# Altium project Drive_edu_bench.PrjPcb (part 1 of 2)
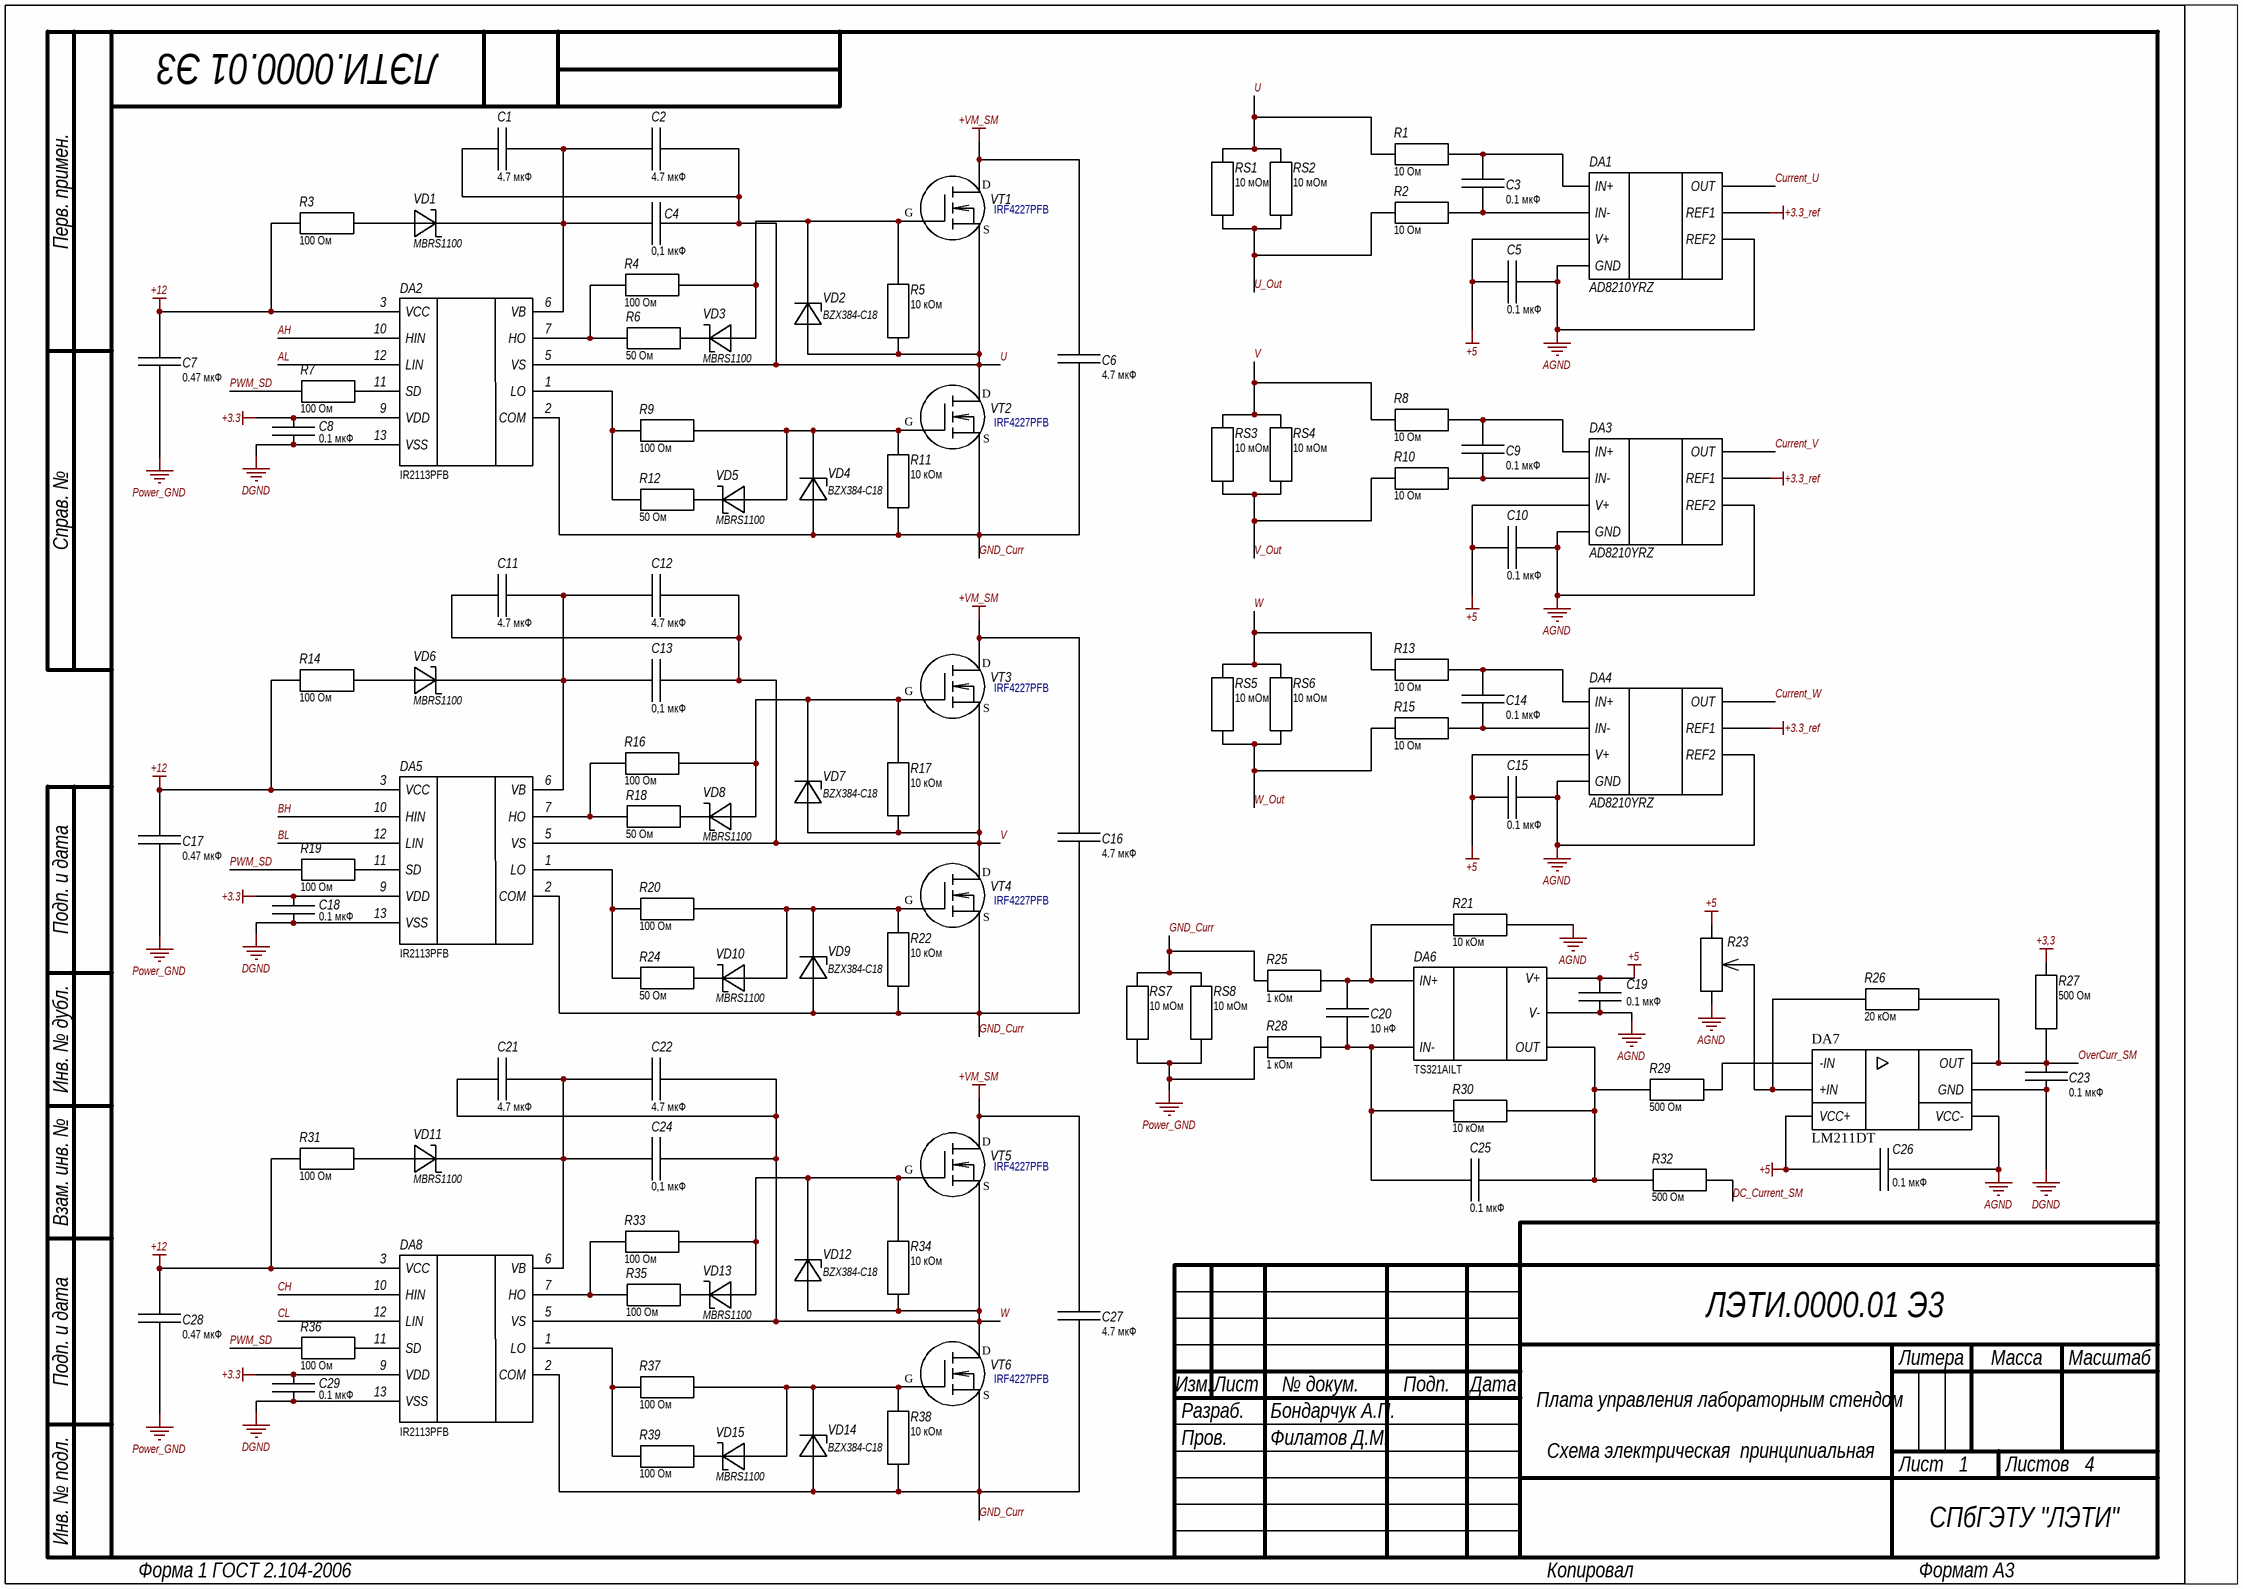
[diagram p0: Voltege_inverter.SchDoc]
7 sheets, 398 parts. Net scope: global (net labels, ports and power ports of the same name join across sheets).
Board file: board.PcbDoc
Sheets:
  Voltege_inverter.SchDoc
  power.SchDoc
  Control_part.SchDoc
  position_sensors.SchDoc
  Communication_interfaces.SchDoc
  protections.SchDoc
  protections_1.SchDoc

## Sheet Voltege_inverter.SchDoc
size 420 x 297 mm; CheckedBy: Филатов Д.М.; Author: Бондарчук А.П.; CompanyName: СПбГЭТУ "ЛЭТИ"; Organization: СПбГЭТУ "ЛЭТИ"; DocumentNumber: ЛЭТИ.0000.01 Э3; SheetNumber: 1; SheetTotal: 4

### Parts
C1  value 4.7 мкФ  [CC1210]  (hidden comment: Capacitor)
C2  value 4.7 мкФ  [CC1210]  (hidden comment: Capacitor)
C3  value 0.1 мкФ  [CC1206]  (hidden comment: Capacitor)
C4  value 0,1 мкФ  [CC0805]  (hidden comment: Capacitor)
C5  value 0.1 мкФ  [CC0603]  (hidden comment: Capacitor)
C6  value 4.7 мкФ  [CC1210]  (hidden comment: Capacitor)
C7  value 0.47 мкФ  [CC1206]  (hidden comment: Capacitor)
C8  value 0.1 мкФ  [CC0603]  (hidden comment: Capacitor)
C9  value 0.1 мкФ  [CC1206]  (hidden comment: Capacitor)
C10  value 0.1 мкФ  [CC0603]  (hidden comment: Capacitor)
C11  value 4.7 мкФ  [CC1210]  (hidden comment: Capacitor)
C12  value 4.7 мкФ  [CC1210]  (hidden comment: Capacitor)
C13  value 0,1 мкФ  [CC0805]  (hidden comment: Capacitor)
C14  value 0.1 мкФ  [CC1206]  (hidden comment: Capacitor)
C15  value 0.1 мкФ  [CC0603]  (hidden comment: Capacitor)
C16  value 4.7 мкФ  [CC1210]  (hidden comment: Capacitor)
C17  value 0.47 мкФ  [CC1206]  (hidden comment: Capacitor)
C18  value 0.1 мкФ  [CC0603]  (hidden comment: Capacitor)
C19  value 0.1 мкФ  [CC0603]  (hidden comment: Capacitor)
C20  value 10 нФ  [CC0805]  (hidden comment: Capacitor)
C21  value 4.7 мкФ  [CC1210]  (hidden comment: Capacitor)
C22  value 4.7 мкФ  [CC1210]  (hidden comment: Capacitor)
C23  value 0.1 мкФ  [CC0603]  (hidden comment: Capacitor)
C24  value 0,1 мкФ  [CC0805]  (hidden comment: Capacitor)
C25  value 0.1 мкФ  [CC1206]  (hidden comment: Capacitor)
C26  value 0.1 мкФ  [CC0603]  (hidden comment: Capacitor)
C27  value 4.7 мкФ  [CC1210]  (hidden comment: Capacitor)
C28  value 0.47 мкФ  [CC1206]  (hidden comment: Capacitor)
C29  value 0.1 мкФ  [CC0603]  (hidden comment: Capacitor)
DA1  AD8210YRZ  [SO8]
DA2  IR2113PFB  [DIP14]
DA3  AD8210YRZ  [SO8]
DA4  AD8210YRZ  [SO8]
DA5  IR2113PFB  [DIP14]
DA6  TS321AILT  [SOT-23-5]
DA7  LM211DT  [SO8]
DA8  IR2113PFB  [DIP14]
R1  value 10 Ом  [RC1206]  (hidden comment: Resistor)
R2  value 10 Ом  [RC1206]  (hidden comment: Resistor)
R3  value 100 Ом  [RC2512]  (hidden comment: Resistor)
R4  value 100 Ом  [RC2512]  (hidden comment: Resistor)
R5  value 10 кОм  [RC0805]  (hidden comment: Resistor)
R6  value 50 Ом  [RC2512]  (hidden comment: Resistor)
R7  value 100 Ом  [RC0603]  (hidden comment: Resistor)
R8  value 10 Ом  [RC1206]  (hidden comment: Resistor)
R9  value 100 Ом  [RC2512]  (hidden comment: Resistor)
R10  value 10 Ом  [RC1206]  (hidden comment: Resistor)
R11  value 10 кОм  [RC0805]  (hidden comment: Resistor)
R12  value 50 Ом  [RC2512]  (hidden comment: Resistor)
R13  value 10 Ом  [RC1206]  (hidden comment: Resistor)
R14  value 100 Ом  [RC2512]  (hidden comment: Resistor)
R15  value 10 Ом  [RC1206]  (hidden comment: Resistor)
R16  value 100 Ом  [RC2512]  (hidden comment: Resistor)
R17  value 10 кОм  [RC0805]  (hidden comment: Resistor)
R18  value 50 Ом  [RC2512]  (hidden comment: Resistor)
R19  value 100 Ом  [RC0603]  (hidden comment: Resistor)
R20  value 100 Ом  [RC2512]  (hidden comment: Resistor)
R21  value 10 кОм  [RC0805]  (hidden comment: Resistor)
R22  value 10 кОм  [RC0805]  (hidden comment: Resistor)
R23  pot  [3296W]  (value not drawn)
R24  value 50 Ом  [RC2512]  (hidden comment: Resistor)
R25  value 1 кОм  [RC0805]  (hidden comment: Resistor)
R26  value 20 кОм  [RC0805]  (hidden comment: Resistor)
R27  value 500 Ом  [RC0805]  (hidden comment: Resistor)
R28  value 1 кОм  [RC0805]  (hidden comment: Resistor)
R29  value 500 Ом  [RC0805]  (hidden comment: Resistor)
R30  value 10 кОм  [RC0805]  (hidden comment: Resistor)
R31  value 100 Ом  [RC2512]  (hidden comment: Resistor)
R32  value 500 Ом  [RC0805]  (hidden comment: Resistor)
R33  value 100 Ом  [RC2512]  (hidden comment: Resistor)
R34  value 10 кОм  [RC0805]  (hidden comment: Resistor)
R35  value 100 Ом  [RC2512]  (hidden comment: Resistor)
R36  value 100 Ом  [RC0603]  (hidden comment: Resistor)
R37  value 100 Ом  [RC2512]  (hidden comment: Resistor)
R38  value 10 кОм  [RC0805]  (hidden comment: Resistor)
R39  value 100 Ом  [RC2512]  (hidden comment: Resistor)
RS1  value 10 мОм  [RC2816]  (hidden comment: Resistor)
RS2  value 10 мОм  [RC2816]  (hidden comment: Resistor)
RS3  value 10 мОм  [RC2816]  (hidden comment: Resistor)
RS4  value 10 мОм  [RC2816]  (hidden comment: Resistor)
RS5  value 10 мОм  [RC2816]  (hidden comment: Resistor)
RS6  value 10 мОм  [RC2816]  (hidden comment: Resistor)
RS7  value 10 мОм  [RC2816]  (hidden comment: Resistor)
RS8  value 10 мОм  [RC2816]  (hidden comment: Resistor)
VD1  MBRS1100  [DO-214AA]
VD2  BZX384-C18  [SOD323]
VD3  MBRS1100  [DO-214AA]
VD4  BZX384-C18  [SOD323]
VD5  MBRS1100  [DO-214AA]
VD6  MBRS1100  [DO-214AA]
VD7  BZX384-C18  [SOD323]
VD8  MBRS1100  [DO-214AA]
VD9  BZX384-C18  [SOD323]
VD10  MBRS1100  [DO-214AA]
VD11  MBRS1100  [DO-214AA]
VD12  BZX384-C18  [SOD323]
VD13  MBRS1100  [DO-214AA]
VD14  BZX384-C18  [SOD323]
VD15  MBRS1100  [DO-214AA]
VT1  IRF4227PFB  [TO247-1]
VT2  IRF4227PFB  [TO247-1]
VT3  IRF4227PFB  [TO247-1]
VT4  IRF4227PFB  [TO247-1]
VT5  IRF4227PFB  [TO247-1]
VT6  IRF4227PFB  [TO247-1]

### Nets
+3,3: R27.2
+3.3: C8.2 C18.2 C29.2 DA2.9(VDD) DA5.9(VDD) DA8.9(VDD)
+3.3_ref: DA1.7(REF1) DA3.7(REF1) DA4.7(REF1)
+5: C5.2 C10.2 C15.2 C19.1 C26.1 DA1.6(V+) DA3.6(V+) DA4.6(V+) DA6.5(V+) DA7.8(VCC+) R23.1
+12: C7.2 C17.2 C28.2 DA2.3(VCC) DA5.3(VCC) DA8.3(VCC) R3.2 R14.2 R31.2
+VM_SM: C6.2 C16.2 C27.2 VT1.D VT3.D VT5.D
AGND: C5.1 C10.1 C15.1 C19.2 C26.2 DA1.2(GND) DA1.3(REF2) DA3.2(GND) DA3.3(REF2) DA4.2(GND) DA4.3(REF2) DA6.2(V-) DA7.4(VCC-) R21.2 R23.3
DGND: C8.1 C18.1 C23.1 C29.1 DA2.13(VSS) DA5.13(VSS) DA7.1(GND) DA8.13(VSS)
Power_GND: C7.1 C17.1 C28.1 R28.1 RS7.2 RS8.2
AH: DA2.10(HIN)
AL: DA2.12(LIN)
BH: DA5.10(HIN)
BL: DA5.12(LIN)
CH: DA8.10(HIN)
CL: DA8.12(LIN)
Current_U: DA1.5(OUT)
Current_V: DA3.5(OUT)
Current_W: DA4.5(OUT)
DC_Current_SM: R32.2
GND_Curr: C6.1 C16.1 C27.1 DA2.2(COM) DA5.2(COM) DA8.2(COM) R11.2 R22.2 R25.1 R38.2 RS7.1 RS8.1 VD4.A VD9.A VD14.A VT2.S VT4.S VT6.S
OverCurr_SM: C23.2 DA7.7(OUT) R26.2 R27.1
PWM_SD: R7.2 R19.2 R36.2
U: C1.2 C2.1 C4.1 DA2.5(VS) R1.2 R5.2 RS1.1 RS2.1 VD2.A VT1.S VT2.D
U_Out: R2.2 RS1.2 RS2.2
V: C11.2 C12.1 C13.1 DA5.5(VS) R8.2 R17.2 RS3.1 RS4.1 VD7.A VT3.S VT4.D
V_Out: R10.2 RS3.2 RS4.2
W: C21.2 C22.1 C24.1 DA8.5(VS) R13.2 R34.2 RS5.1 RS6.1 VD12.A VT5.S VT6.D
W_Out: R15.2 RS5.2 RS6.2
NetC1_1: C1.1 C2.2 C4.2 DA2.6(VB) VD1.C
NetC3_1: C3.1 DA1.8(IN+) R1.1
NetC3_2: C3.2 DA1.1(IN-) R2.1
NetC9_1: C9.1 DA3.8(IN+) R8.1
NetC9_2: C9.2 DA3.1(IN-) R10.1
NetC11_1: C11.1 C12.2 C13.2 DA5.6(VB) VD6.C
NetC14_1: C14.1 DA4.8(IN+) R13.1
NetC14_2: C14.2 DA4.1(IN-) R15.1
NetC20_1: C20.1 DA6.3(IN+) R21.1 R25.2
NetC20_2: C20.2 C25.1 DA6.4(IN-) R28.2 R30.1
NetC21_1: C21.1 C22.2 C24.2 DA8.6(VB) VD11.C
NetC25_2: C25.2 DA6.1(OUT) R29.1 R30.2 R32.1
NetDA2_1: DA2.1(LO) R9.2 R12.2
NetDA2_7: DA2.7(HO) R4.2 R6.2
NetDA2_11: DA2.11(SD) R7.1
NetDA5_1: DA5.1(LO) R20.2 R24.2
NetDA5_7: DA5.7(HO) R16.2 R18.2
NetDA5_11: DA5.11(SD) R19.1
NetDA7_2: DA7.2(+IN) R23.2 R26.1
NetDA7_3: DA7.3(-IN) R29.2
NetDA8_1: DA8.1(LO) R37.2 R39.2
NetDA8_7: DA8.7(HO) R33.2 R35.2
NetDA8_11: DA8.11(SD) R36.1
NetR3_1: R3.1 VD1.A
NetR4_1: R4.1 R5.1 VD2.C VD3.A VT1.G
NetR6_1: R6.1 VD3.C
NetR9_1: R9.1 R11.1 VD4.C VD5.A
NetR12_1: R12.1 VD5.C
NetR14_1: R14.1 VD6.A
NetR16_1: R16.1 R17.1 VD7.C VD8.A VT3.G
NetR18_1: R18.1 VD8.C
NetR20_1: R20.1 R22.1 VD9.C VD10.A
NetR24_1: R24.1 VD10.C
NetR31_1: R31.1 VD11.A
NetR33_1: R33.1 R34.1 VD12.C VD13.A VT5.G
NetR35_1: R35.1 VD13.C
NetR37_1: R37.1 R38.1 VD14.C VD15.A
NetR39_1: R39.1 VD15.C

Not connected (* = marked no-connect by the designer): VT2 G; VT4 G; VT6 G

### Notes on the sheet
- Плата управления лабораторным стендом
- Перв. примен.
- Справ. №
- Подп. и дата
- Инв. № дубл.
- Взам. инв. №
- Разраб.
- Изм.
- Лист
- № докум.
- Подп.
- Дата
- Литера
- Масса
- Масштаб
- Пров.
- Схема электрическая  принципиальная
- Листов
- Инв. № подл.
- Форма 1 ГОСТ 2.104-2006
- Копировал
- Формат А3

### Library data of the parts
C1-C4 C6 C9 C11-C14 C16 C21 C22 C24 C25 C27 = Capacitor: Voltage: 100В; ComponentLink1Description: Product link; GOST_Name_2: 100В; GOST_Name_0: -
  C1 C2 C6 C11 C12 C16 C21 C22 C27: ComponentLink1URL: https://www.promelec.ru/product/413761/; Name: CC1210; GOST_Name_3: 4.7 мкФ
  C3 C9 C14 C25: ComponentLink1URL: *; Name: CC1206; GOST_Name_3: 0.1 мкФ
  C4 C13 C24: ComponentLink1URL: *; Name: CC0805; GOST_Name_3: 0,1 мкФ
C5 C8 C10 C15 C18 C19 C23 C26 C29 = Capacitor: Voltage: 16В; ComponentLink1Description: Product link; ComponentLink1URL: *; Name: CC0603; GOST_Name_2: 16В; GOST_Name_3: 0.1 мкФ; GOST_Name_0: -
C7 C17 C20 C28 = Capacitor: Voltage: 50В; ComponentLink1Description: Product link; ComponentLink1URL: *; GOST_Name_2: 50В; GOST_Name_0: -
  C7 C17 C28: Name: CC1206; GOST_Name_3: 0.47 мкФ
  C20: Name: CC0805; GOST_Name_3: 10 нФ
DA1 DA3 DA4 = AD8210: Name: AD8210YRZ, ф Analog Devices; ComponentLink1Description: Product link; ComponentLink1URL: https://www.chipdip.ru/product/ad8210yrz; Datasheet: https://static.chipdip.ru/lib/693/DOC011693392.pdf; GOST_Name_1: AD8210YRZ, ф Analog Devices
DA2 DA5 DA8 = IR2113PFB: Name: IR2113PBF, ф. Infineon Technologies; ComponentLink1Description: Product link; ComponentLink1URL: https://www.promelec.ru/product/39435/; GOST_Name_1: IR2113PBF, ф. Infineon Technologies
DA6 = TS321AILT: Одиночный операционный усилитель.; Name: TS321AILT ф. STMicroelectronics; ComponentLink1Description: Product link; ComponentLink1URL: https://www.chipdip.ru/product/ts321ailt-stm; Datasheet: https://static.chipdip.ru/lib/693/DOC011693392.pdf; GOST_Name_1: TS321AILT ф. STMicroelectronics
DA7 = LM211DT: Компаратор; GOST_Name_1: LM211DT, ф ST Microelectronics; ComponentLink1Description: Product link; ComponentLink1URL: https://www.promelec.ru/product/40196/
R1 R2 R8 R10 R13 R15 = Resistor: Power: 250 мВт; ComponentLink1Description: Product link; ComponentLink1URL: *; Name: RC1206; GOST_Name_2: 250 мВт; GOST_Name_3: 10 Ом; GOST_Name_0: -
R3 R4 R6 R9 R12 R14 R16 R18 R20 R24 R31 R33 R35 R37 R39 = Resistor: Power: 1 Вт; ComponentLink1Description: Product link; ComponentLink1URL: *; Name: RC2512; GOST_Name_2: 1 Вт; GOST_Name_0: -
  R3 R4 R9 R14 R16 R20 R31 R33 R35 R37 R39: GOST_Name_3: 100 Ом
  R6 R12 R18 R24: GOST_Name_3: 50 Ом
R5 R11 R17 R21 R22 R25-R30 R32 R34 R38 = Resistor: Power: 125 мВт; ComponentLink1Description: Product link; ComponentLink1URL: *; Name: RC0805; GOST_Name_2: 125 мВт; GOST_Name_0: -
  R5 R11 R17 R21 R22 R30 R34 R38: GOST_Name_3: 10 кОм
  R25 R28: GOST_Name_3: 1 кОм
  R26: GOST_Name_3: 20 кОм
  R27 R29 R32: GOST_Name_3: 500 Ом
R7 R19 R36 = Resistor: Power: 100 мВт; ComponentLink1Description: Product link; ComponentLink1URL: *; Name: RC0603; GOST_Name_2: 100 мВт; GOST_Name_3: 100 Ом; GOST_Name_0: -
R23 = pot: Name: 10 кОм ± 20% 0,5 Вт, 3296W-1-103LF, ф. Bourns; ComponentLink1Description: Product link; GOST_Name_1: 10 кОм ± 20% 0,5 Вт, 3296W-1-103LF, ф. Bourns
RS1-RS8 = Resistor: Power: 2 Вт; ComponentLink1Description: Product link; ComponentLink1URL: *; Name: RC2816; GOST_Name_2: 2 Вт; GOST_Name_3: 10 мОм; GOST_Name_0: -
VD1 VD3 VD5 VD6 VD8 VD10 VD11 VD13 VD15 = Shotki: Name: MBRS1100, 100В, 1А, ф. Sunmate Electronics; ComponentLink1Description: Product link; ComponentLink1URL: https://www.chipdip.ru/product/mbrs1100; GOST_Name_1: MBRS1100, 100В, 1А, ф. Sunmate Electronics
VD2 VD4 VD7 VD9 VD12 VD14 = Zener diode: Name: BZX384-C18,115, Стабилитрон 18В 0.3Вт, ф Nexperia; ComponentLink1Description: Product link; ComponentLink1URL: https://www.chipdip.ru/product/bzx384-c18.115; GOST_Name_1: BZX384-C18,115, Стабилитрон 18В 0.3Вт, ф Nexperia
VT1-VT6 = N-MOSFET: Name: IRF4227PFB

## Sheet power.SchDoc
size 420 x 297 mm; SheetNumber: 3
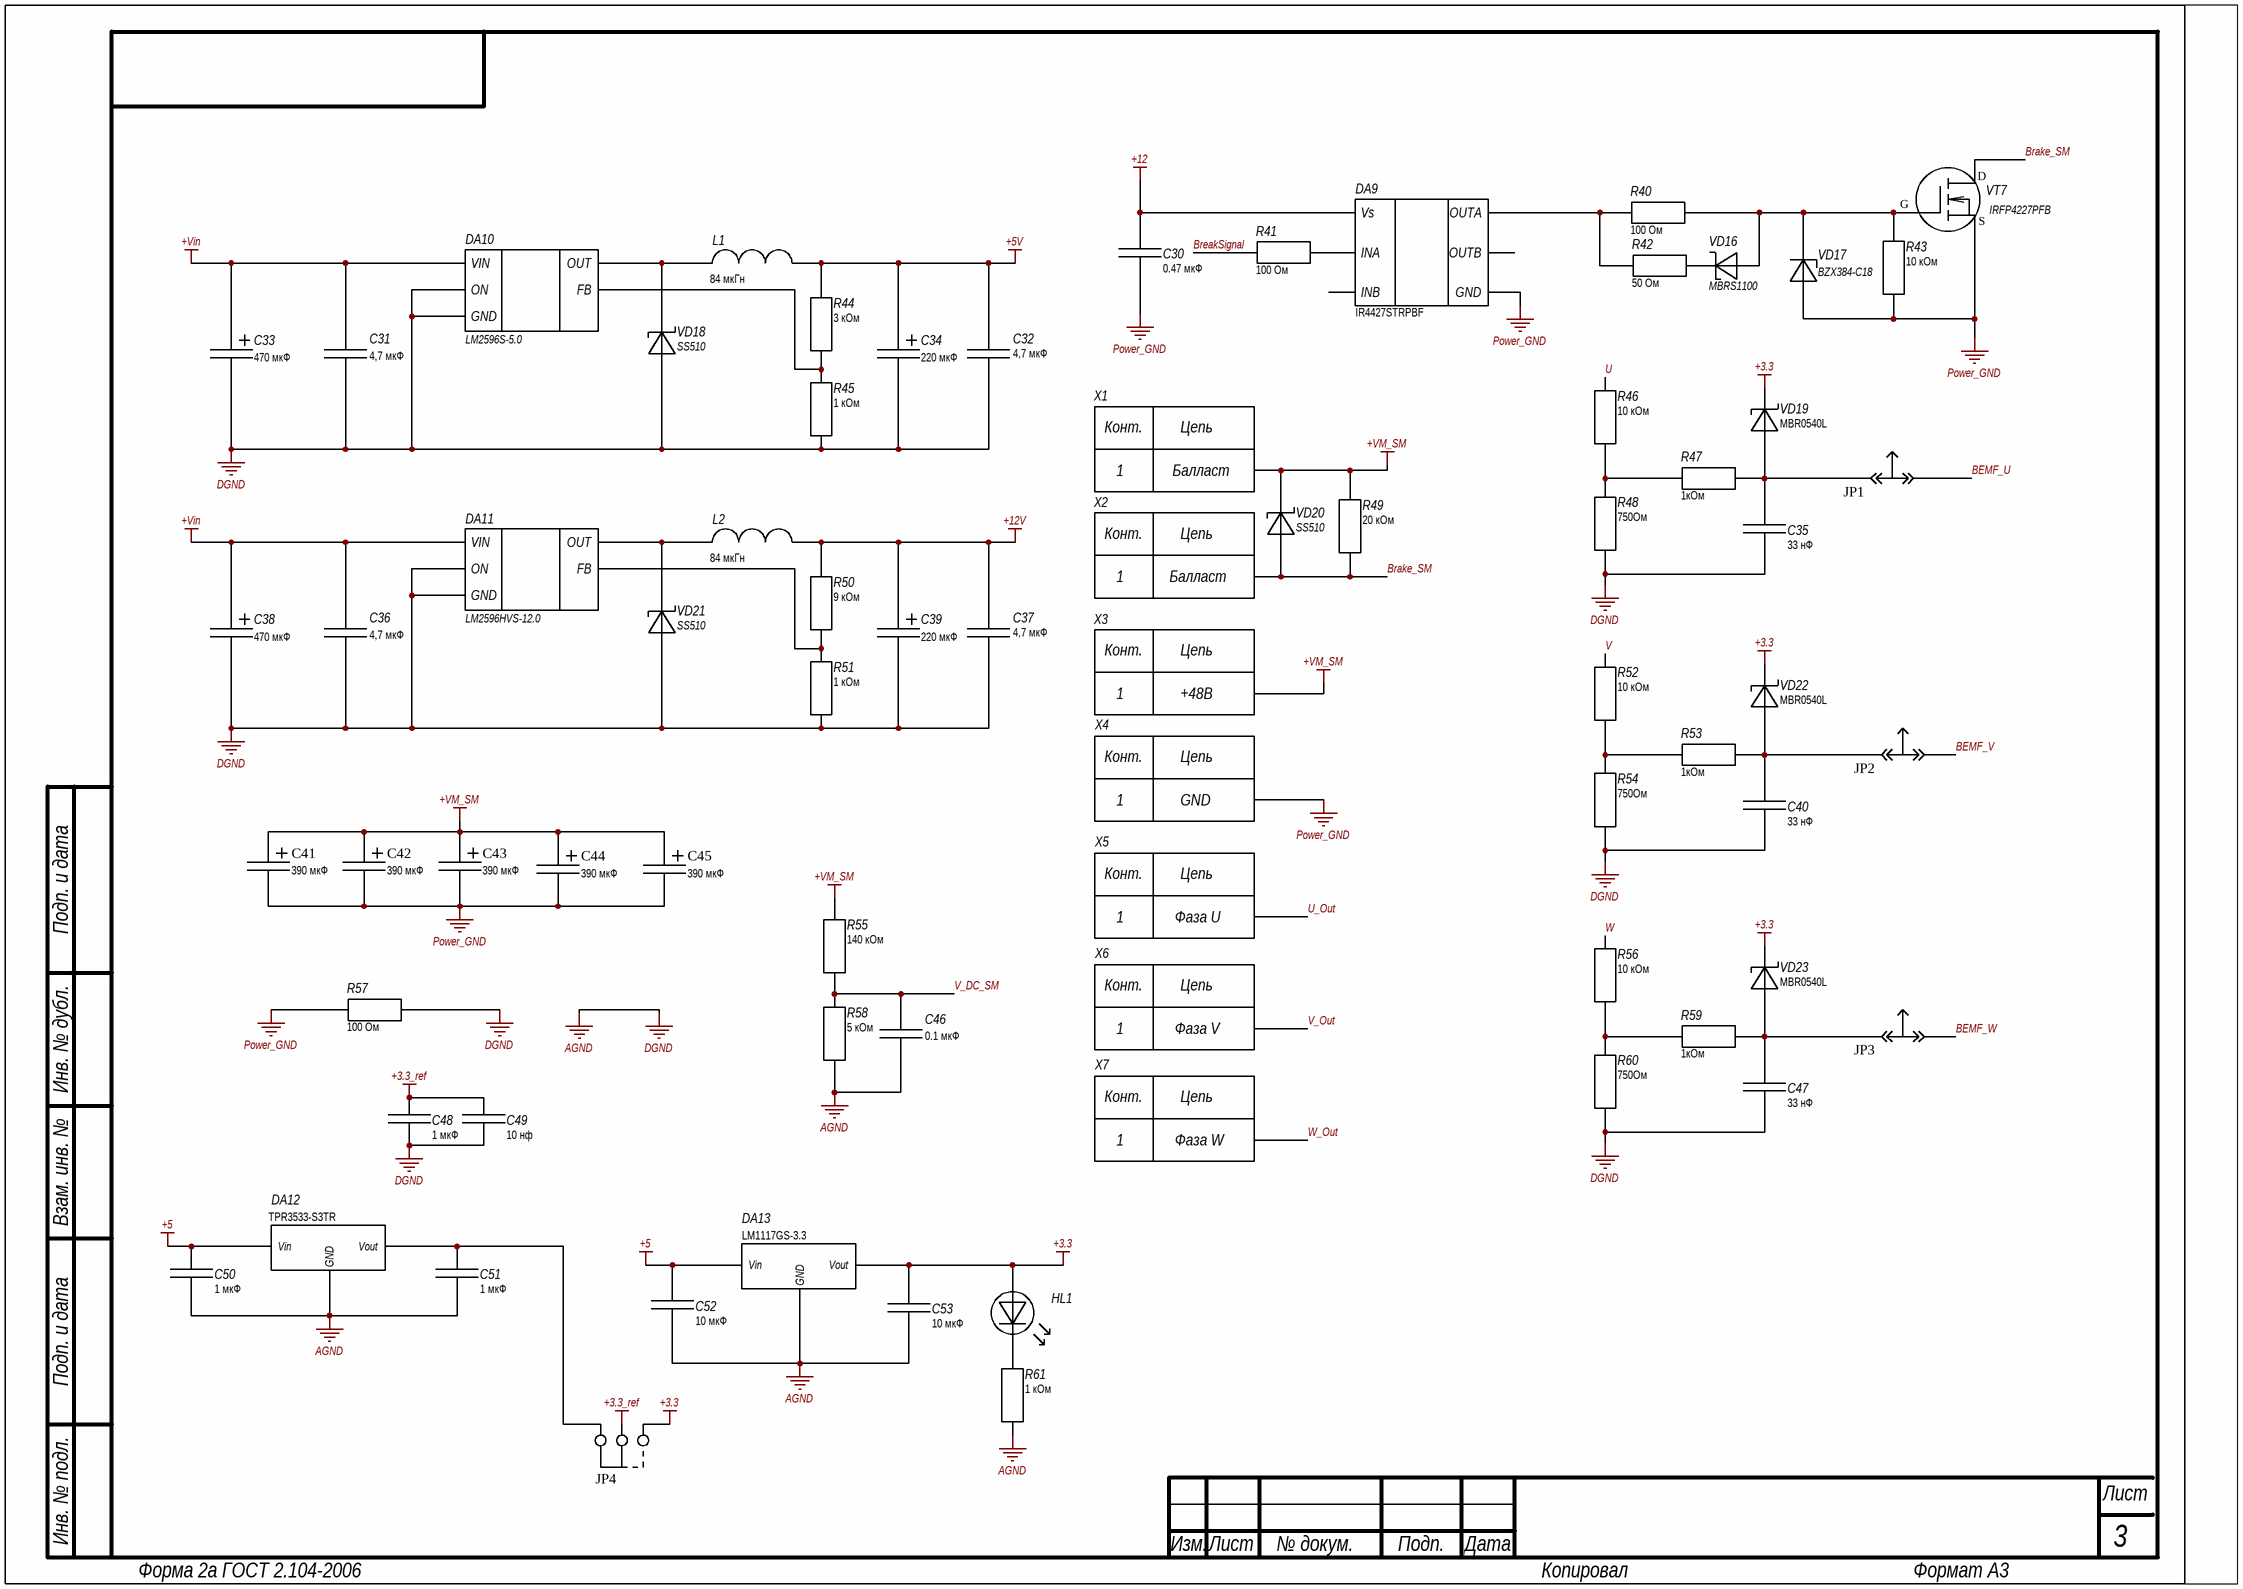
[diagram p1: power.SchDoc]

### Parts
1  Net Tie  [Net Tie]  (value not drawn)  (net tie, no BOM)
C30  value 0.47 мкФ  [CC1206]  (hidden comment: Capacitor)
C31  value 4,7 мкФ  [CC1206]  (hidden comment: Capacitor)
C32  value 4,7 мкФ  [CC1206]  (hidden comment: Capacitor)
C33  value 470 мкФ  [CAP-5-12.5]  (hidden comment: EXR471M50B)
C34  value 220 мкФ  [CAP-5-10]  (hidden comment: B41858C7227M)
C35  value 33 нФ  [CC0805]  (hidden comment: Capacitor)
C36  value 4,7 мкФ  [CC1206]  (hidden comment: Capacitor)
C37  value 4,7 мкФ  [CC1206]  (hidden comment: Capacitor)
C38  value 470 мкФ  [CAP-5-12.5]  (hidden comment: EXR471M50B)
C39  value 220 мкФ  [CAP-5-10]  (hidden comment: B41858C7227M)
C40  value 33 нФ  [CC0805]  (hidden comment: Capacitor)
C41  value 390 мкФ  [CAP-7.5-18]  (hidden comment: Сapacitor pol)
C42  value 390 мкФ  [CAP-7.5-18]  (hidden comment: Сapacitor pol)
C43  value 390 мкФ  [CAP-7.5-18]  (hidden comment: Сapacitor pol)
C44  value 390 мкФ  [CAP-7.5-18]  (hidden comment: Сapacitor pol)
C45  value 390 мкФ  [CAP-7.5-18]  (hidden comment: Сapacitor pol)
C46  value 0.1 мкФ  [CC0603]  (hidden comment: Capacitor)
C47  value 33 нФ  [CC0805]  (hidden comment: Capacitor)
C48  value 1 мкФ  [CC0603]  (hidden comment: Capacitor)
C49  value 10 нф  [CC0402]  (hidden comment: Capacitor)
C50  value 1 мкФ  [CC0805]  (hidden comment: Capacitor)
C51  value 1 мкФ  [CC0805]  (hidden comment: Capacitor)
C52  value 10 мкФ  [CC1206]  (hidden comment: Capacitor)
C53  value 10 мкФ  [CC1206]  (hidden comment: Capacitor)
DA9  IR4427STRPBF  [SO8]
DA10  LM2596S-5.0  [TO263-5L]
DA11  LM2596HVS-12.0  [TO263-5L]
DA12  TPR3533-S3TR  [SOT-23-5]
DA13  LM1117GS-3.3  [SOT-223]
HL1  LED  [CC1206]  (value not drawn)
JP1  Jumper-2  [PLS2]  (value not drawn)  (no BOM)
JP2  Jumper-2  [PLS2]  (value not drawn)  (no BOM)
JP3  Jumper-2  [PLS2]  (value not drawn)  (no BOM)
JP4  Jumper  [PLS3]  (value not drawn)
L1  value 84 мкГн  [CDRH127/LDNP-820MC]  (hidden comment: CDRH127/LDNP-820MC)
L2  value 84 мкГн  [CDRH127/LDNP-820MC]  (hidden comment: CDRH127/LDNP-820MC)
R40  value 100 Ом  [RC2512]  (hidden comment: Resistor)
R41  value 100 Ом  [RC0603]  (hidden comment: Resistor)
R42  value 50 Ом  [RC2512]  (hidden comment: Resistor)
R43  value 10 кОм  [RC0805]  (hidden comment: Resistor)
R44  value 3 кОм  [RC0805]  (hidden comment: Resistor)
R45  value 1 кОм  [RC0805]  (hidden comment: Resistor)
R46  value 10 кОм  [RC1206]  (hidden comment: Resistor)
R47  value 1кОм  [RC0805]  (hidden comment: Resistor)
R48  value 750Ом  [RC1206]  (hidden comment: Resistor)
R49  value 20 кОм  [RC1206]  (hidden comment: Resistor)
R50  value 9 кОм  [RC0805]  (hidden comment: Resistor)
R51  value 1 кОм  [RC0805]  (hidden comment: Resistor)
R52  value 10 кОм  [RC1206]  (hidden comment: Resistor)
R53  value 1кОм  [RC0805]  (hidden comment: Resistor)
R54  value 750Ом  [RC1206]  (hidden comment: Resistor)
R55  value 140 кОм  [RC1206]  (hidden comment: Resistor)
R56  value 10 кОм  [RC1206]  (hidden comment: Resistor)
R57  value 100 Ом  [RC2512]  (hidden comment: Resistor)
R58  value 5 кОм  [RC1206]  (hidden comment: Resistor)
R59  value 1кОм  [RC0805]  (hidden comment: Resistor)
R60  value 750Ом  [RC1206]  (hidden comment: Resistor)
R61  value 1 кОм  [RC0805]  (hidden comment: Resistor)
VD16  MBRS1100  [DO-214AA]
VD17  BZX384-C18  [SOD323]
VD18  SS510  [DO214AB]
VD19  MBR0540L  [SOD123]
VD20  SS510  [DO214AB]
VD21  SS510  [DO214AB]
VD22  MBR0540L  [SOD123]
VD23  MBR0540L  [SOD123]
VT7  IRFP4227PFB  [TO247-1]
X1  Connector-1  [PCBM4]  (value not drawn)
X2  Connector-1  [PCBM4]  (value not drawn)
X3  Connector-1  [PCBM4]  (value not drawn)
X4  Connector-1  [PCBM4]  (value not drawn)
X5  Connector-1  [PCBM4]  (value not drawn)
X6  Connector-1  [PCBM4]  (value not drawn)
X7  Connector-1  [PCBM4]  (value not drawn)

### Nets
+3.3: C53.1 DA13.2(Vout) HL1.A JP4.1 VD19.C VD22.C VD23.C
+3.3_ref: C48.1 C49.1 JP4.2
+5: C50.1 C52.1 DA12.1(Vin) DA13.3(Vin)
+5V: C32.2 C34.1 L1.2 R44.1
+12: C30.2 DA9.6(Vs)
+12V: C37.2 C39.1 L2.2 R50.1
+Vin: C31.2 C33.1 C36.2 C38.1 DA10.1(VIN) DA11.1(VIN)
+VM_SM: C41.1 C42.1 C43.1 C44.1 C45.1 R49.1 R55.1 VD20.C X1.1 X3.1
AGND: 1.1 C46.1 C50.2 C51.2 C52.2 C53.2 DA12.3(GND) DA13.1(GND) R58.2 R61.2
DGND: 1.2 C31.1 C32.1 C33.2 C34.2 C35.1 C36.1 C37.1 C38.2 C39.2 C40.1 C47.1 C48.2 C49.2 DA10.3(GND) DA10.5(ON) DA11.3(GND) DA11.5(ON) R45.2 R48.2 R51.2 R54.2 R57.1 R60.2 VD18.A VD21.A
Power_GND: C30.1 C41.2 C42.2 C43.2 C44.2 C45.2 DA9.3(GND) R43.2 R57.2 VD17.A VT7.S X4.1
BEMF_U: JP1.2
BEMF_V: JP2.2
BEMF_W: JP3.2
Brake_SM: R49.2 VD20.A VT7.D X2.1
BreakSignal: R41.2
U: R46.1
U_Out: X5.1
V: R52.1
V_DC_SM: C46.2 R55.2 R58.1
V_Out: X6.1
W: R56.1
W_Out: X7.1
NetC35_2: C35.2 JP1.1 R47.2 VD19.A
NetC40_2: C40.2 JP2.1 R53.2 VD22.A
NetC47_2: C47.2 JP3.1 R59.2 VD23.A
NetC51_1: C51.1 DA12.2(Vout) JP4.3
NetDA9_2: DA9.2(INA) R41.1
NetDA9_7: DA9.7(OUTA) R40.2 R42.2
NetDA10_2: DA10.2(OUT) L1.1 VD18.C
NetDA10_4: DA10.4(FB) R44.2 R45.1
NetDA11_2: DA11.2(OUT) L2.1 VD21.C
NetDA11_4: DA11.4(FB) R50.2 R51.1
NetHL1_C: HL1.C R61.1
NetR40_1: R40.1 R43.1 VD16.A VD17.C VT7.G
NetR42_1: R42.1 VD16.C
NetR46_2: R46.2 R47.1 R48.1
NetR52_2: R52.2 R53.1 R54.1
NetR56_2: R56.2 R59.1 R60.1

Not connected (* = marked no-connect by the designer): DA9 4(INB) 5(OUTB)

### Notes on the sheet
- (near X1) Балласт
- (near X2) Балласт
- (near X3) +48В
- (near X4) GND
- (near X5) Фаза U
- (near X6) Фаза V
- (near X7) Фаза W
- Подп. и дата
- Инв. № дубл.
- Взам. инв. №
- Инв. № подл.
- Изм.
- Лист
- № докум.
- Подп.
- Дата
- Форма 2а ГОСТ 2.104-2006
- Копировал
- Формат А3
- (in symbol Connector-1) Конт.; Цепь

### Library data of the parts
C30 C35 C40 C47 = Capacitor: Voltage: 50В; ComponentLink1Description: Product link; ComponentLink1URL: *; GOST_Name_1: =Name; GOST_Name_2: 50В; GOST_Name_0: -
  C30: Name: CC1206; GOST_Name_3: 0.47 мкФ
  C35 C40 C47: Name: CC0805; GOST_Name_3: 33 нФ
C31 C32 C36 C37 C46 = Capacitor: Voltage: 50 В; ComponentLink1Description: Product link; ComponentLink1URL: *; GOST_Name_1: =Name; GOST_Name_2: 50 В; GOST_Name_0: -
  C31 C32 C36 C37: Name: CC1206; GOST_Name_3: 4,7 мкФ
  C46: Name: CC0603; GOST_Name_3: 0.1 мкФ
C33 C38 = Сapacitor pol: Voltage: 50 В; ComponentLink1Description: Product link; ComponentLink1URL: https://www.promelec.ru/product/396474/; Type: *; Name: EXR471M50B; GOST_Name_1: =Name; GOST_Name_2: 50 В; GOST_Name_3: 470 мкФ; GOST_Name_0: -
C34 C39 = Сapacitor pol: Voltage: 35 В; ComponentLink1Description: Product link; ComponentLink1URL: https://www.promelec.ru/product/134576/; Type: *; Name: B41858C7227M; GOST_Name_1: =Name; GOST_Name_2: 35 В; GOST_Name_3: 220 мкФ; GOST_Name_0: -
C41-C45 = Сapacitor pol: Name: B41858C9397M-100 В-390 мкФ; ComponentLink1Description: Product link; ComponentLink1URL: *; Type: *; GOST_Name_1: B41858C9397M-100 В-390 мкФ
C48 = Capacitor: Voltage: 10В; ComponentLink1Description: Product link; ComponentLink1URL: *; Name: CC0603; GOST_Name_1: =Name; GOST_Name_2: 10В; GOST_Name_3: 1 мкФ; GOST_Name_0: -
C49 = Capacitor: Voltage: 16В; ComponentLink1Description: Product link; ComponentLink1URL: *; Name: CC0402; GOST_Name_1: =Name; GOST_Name_2: 16В; GOST_Name_3: 10 нф; GOST_Name_0: -
C50-C53 = Capacitor: Voltage: 25 В; ComponentLink1Description: Product link; ComponentLink1URL: *; GOST_Name_1: =Name; GOST_Name_2: 25 В; GOST_Name_0: -
  C50 C51: Name: CC0805; GOST_Name_3: 1 мкФ
  C52 C53: Name: CC1206; GOST_Name_3: 10 мкФ
DA9 = IR4427STRPBF: Драйвер сдвоенный нижнего плеча 8SOIC; Name: IR4427STRPBF, ф. Infineon Technologies; ComponentLink1Description: Product link; ComponentLink1URL: https://www.promelec.ru/product/203606/; GOST_Name_1: IR4427STRPBF, ф. Infineon Technologies
DA10 DA11 = LM2596: GOST_Name_2: ' ф.  UMW Youtai Semiconductor'; ComponentLink1Description: Product link; ComponentLink1URL: https://www.promelec.ru/search/?query=LM2596; GOST_Name_1: =Name
  DA10: Name: LM2596S-5.0
  DA11: Name: LM2596HVS-12.0
DA12 = TPR3533-S3TR: Источник опорного напряжения 3.3В; Name: TPR3533-S3TR ф 3PEAK; ComponentLink1Description: Product link; ComponentLink1URL: https://www.chipdip.ru/product0/8017231744; GOST_Name_1: TPR3533-S3TR ф 3PEAK
DA13 = LM1117GS-3.3: Линейный регулятор с низким падением напряжения, +3.3 В, 1А; Name: LM1117GS-3.3, ф TAEJIN TECHNOLOGY Co., Ltd.; ComponentLink1Description: Product link; ComponentLink1URL: https://www.chipdip.ru/product/lm1117gs-3.3; GOST_Name_1: LM1117GS-3.3, ф TAEJIN TECHNOLOGY Co., Ltd.
HL1 = LED: Name: GNL-1206EC; ComponentLink1Description: Product link; GOST_Name_1: GNL-1206EC
L1 L2 = Inductor: Current: 2.4 А; Name: CDRH127/LDNP-820MC; ComponentLink1Description: Product link; ComponentLink1URL: https://www.promelec.ru/product/347591/; GOST_Name_1: =Name; GOST_Name_2: 2.4 А; GOST_Name_3: 84 мкГн; GOST_Name_0: -
R40 R42 R57 = Resistor: Power: 1 Вт; ComponentLink1Description: Product link; ComponentLink1URL: *; Name: RC2512; GOST_Name_1: =Name; GOST_Name_2: 1 Вт; GOST_Name_0: -
  R40 R57: GOST_Name_3: 100 Ом
  R42: GOST_Name_3: 50 Ом
R41 = Resistor: Power: 100 мВт; ComponentLink1Description: Product link; ComponentLink1URL: *; Name: RC0603; GOST_Name_1: =Name; GOST_Name_2: 100 мВт; GOST_Name_3: 100 Ом; GOST_Name_0: -
R43-R48 R50-R54 R56 R59-R61 = Resistor: Power: 125 мВт; ComponentLink1Description: Product link; ComponentLink1URL: *; GOST_Name_1: =Name; GOST_Name_2: 125 мВт; GOST_Name_0: -
  R43: Name: RC0805; GOST_Name_3: 10 кОм
  R44: Name: RC0805; GOST_Name_3: 3 кОм
  R45 R51 R61: Name: RC0805; GOST_Name_3: 1 кОм
  R46 R52 R56: Name: RC1206; GOST_Name_3: 10 кОм
  R47 R53 R59: Name: RC0805; GOST_Name_3: 1кОм
  R48 R54 R60: Name: RC1206; GOST_Name_3: 750Ом
  R50: Name: RC0805; GOST_Name_3: 9 кОм
R49 R55 R58 = Resistor: Power: 250 мВт; ComponentLink1Description: Product link; ComponentLink1URL: *; Name: RC1206; GOST_Name_1: =Name; GOST_Name_2: 250 мВт; GOST_Name_0: -
  R49: GOST_Name_3: 20 кОм
  R55: GOST_Name_3: 140 кОм
  R58: GOST_Name_3: 5 кОм
VD16 = Shotki: as VD1 on sheet Voltege_inverter; ComponentLink1Description: Product link; ComponentLink1URL: https://www.chipdip.ru/product/mbrs1100; GOST_Name_1: MBRS1100, 100В, 1А, ф. Sunmate Electronics
VD17 = Zener diode: as VD2 on sheet Voltege_inverter; ComponentLink1Description: Product link; ComponentLink1URL: https://www.chipdip.ru/product/bzx384-c18.115; GOST_Name_1: BZX384-C18,115, Стабилитрон 18В 0.3Вт, ф Nexperia
VD18 VD20 VD21 = Shotki: Name: SS510, 100В, 5А, ф. Hottech Co. Ltd; ComponentLink1Description: Product link; ComponentLink1URL: https://www.promelec.ru/product/386699/; GOST_Name_1: SS510, 100В, 5А, ф. Hottech Co. Ltd
VD19 VD22 VD23 = Shotki: Name: MBR0540L, 40В, 0.5А, ф. Hottech; ComponentLink1Description: Product link; GOST_Name_1: MBR0540L, 40В, 0.5А, ф. Hottech
VT7 = N-MOSFET: ComponentLink1Description: Product link; ComponentLink1URL: https://www.chipdip.ru/product/irfp4710pbf; GOST_Name_1: IRFP4227PFB; Name: IRFP4227PFB
X1-X7 = Connector-1: Name: Соединение винтовое 10х5мм, М4; ComponentLink1Description: Product link; GOST_Name_1: Соединение винтовое 10х5мм, М4
1 = Net Tie: ComponentLink1Description: Product link; ComponentLink1URL: https://www.chipdip.ru/product/stps2h100a-2
JP1-JP3 = Jumper-2: ComponentLink1Description: Product link; ComponentLink1URL: https://www.chipdip.ru/product/stps2h100a-2
JP4 = Jumper: ComponentLink1Description: Product link; ComponentLink1URL: https://www.chipdip.ru/product/stps2h100a-2

## Sheet Control_part.SchDoc
size 420 x 297 mm; SheetNumber: 4
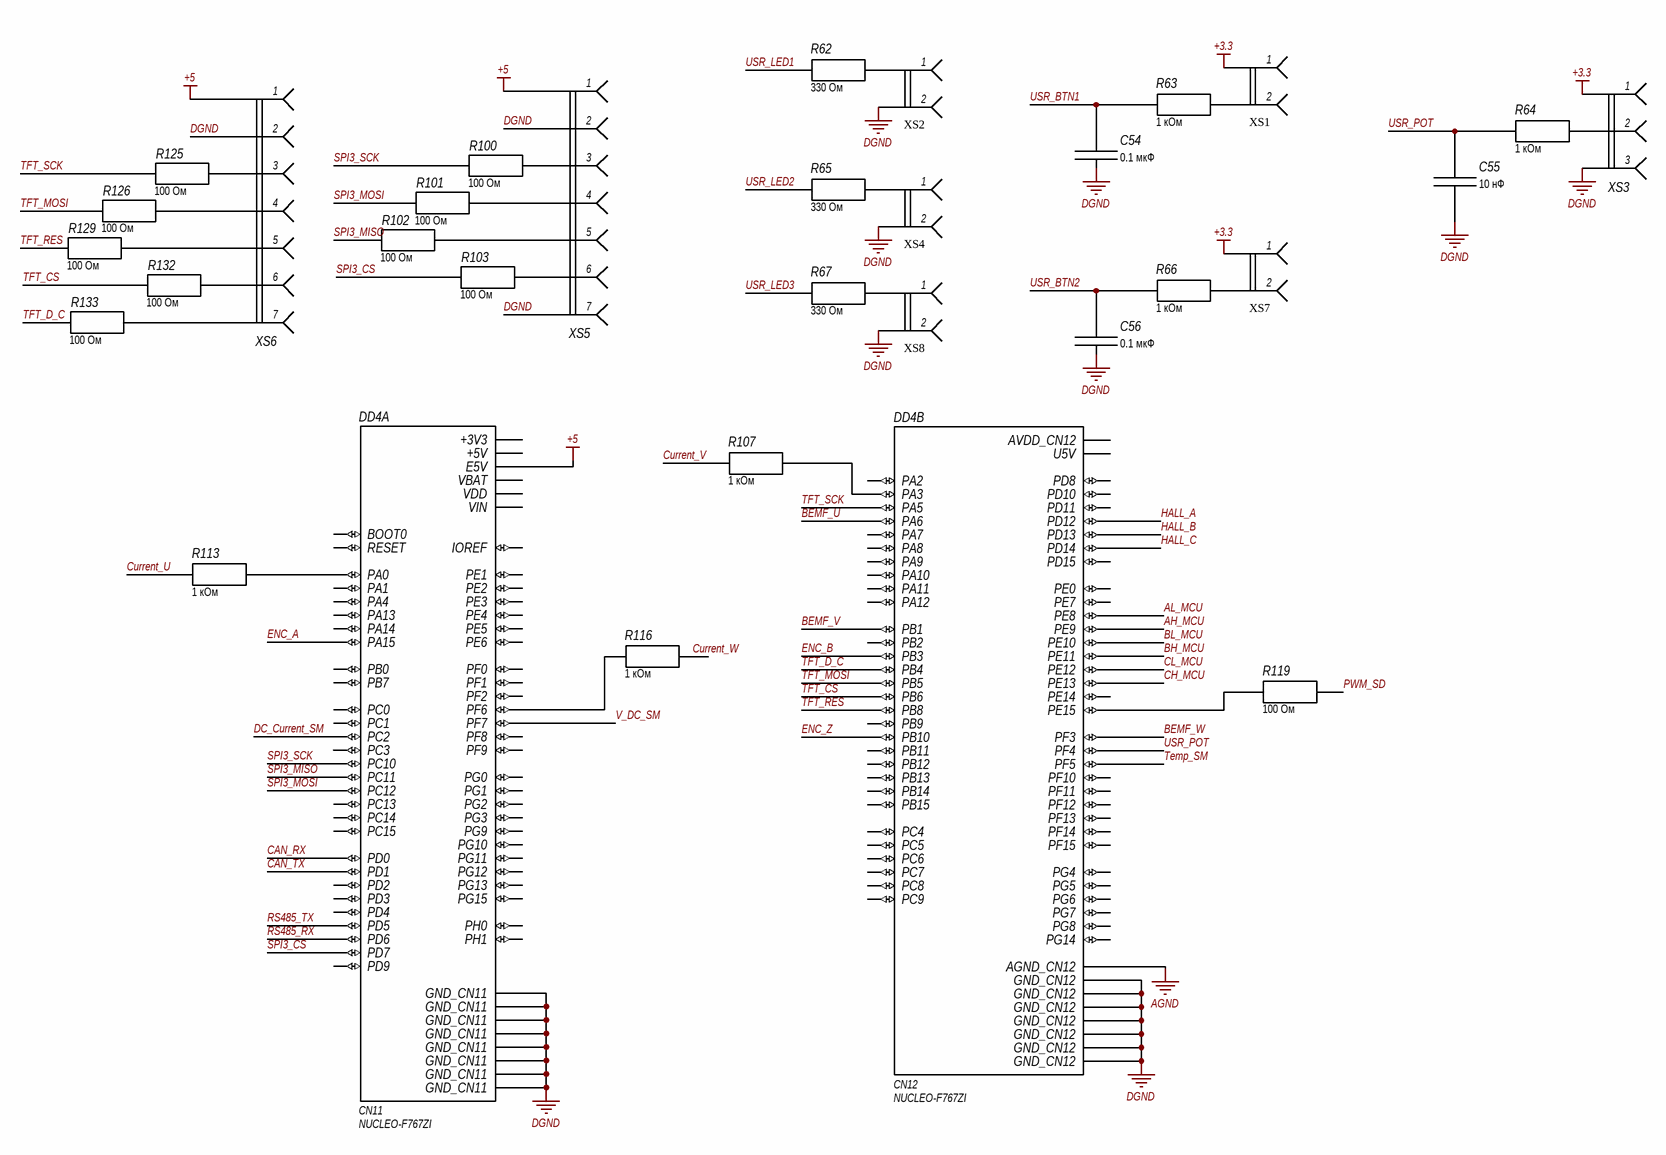
[diagram p2: Control_part.SchDoc]

### Parts
C54  value 0.1 мкФ  [CC0603]  (hidden comment: Capacitor)
C55  value 10 нФ  [CC0603]  (hidden comment: Capacitor)
C56  value 0.1 мкФ  [CC0603]  (hidden comment: Capacitor)
DD4  NUCLEO-F767ZI  [ST_NUCLEO-F767ZI]  (parts A,B of 6)
R62  value 330 Ом  [RC1206]  (hidden comment: Resistor)
R63  value 1 кОм  [RC0603]  (hidden comment: Resistor)
R64  value 1 кОм  [RC0603]  (hidden comment: Resistor)
R65  value 330 Ом  [RC1206]  (hidden comment: Resistor)
R66  value 1 кОм  [RC0603]  (hidden comment: Resistor)
R67  value 330 Ом  [RC1206]  (hidden comment: Resistor)
R100  value 100 Ом  [RC0603]  (hidden comment: Resistor)
R101  value 100 Ом  [RC0603]  (hidden comment: Resistor)
R102  value 100 Ом  [RC0603]  (hidden comment: Resistor)
R103  value 100 Ом  [RC0603]  (hidden comment: Resistor)
R107  value 1 кОм  [RC0603]  (hidden comment: Resistor)
R113  value 1 кОм  [RC0603]  (hidden comment: Resistor)
R116  value 1 кОм  [RC0603]  (hidden comment: Resistor)
R119  value 100 Ом  [RC0603]  (hidden comment: Resistor)
R125  value 100 Ом  [RC0603]  (hidden comment: Resistor)
R126  value 100 Ом  [RC0603]  (hidden comment: Resistor)
R129  value 100 Ом  [RC0603]  (hidden comment: Resistor)
R132  value 100 Ом  [RC0603]  (hidden comment: Resistor)
R133  value 100 Ом  [RC0603]  (hidden comment: Resistor)
XS1  JST-Male-2  [JST-2]  (value not drawn)
XS2  JST-Male-2  [JST-2]  (value not drawn)
XS3  JST-Male-3  [JST-3]  (value not drawn)
XS4  JST-Male-2  [JST-2]  (value not drawn)
XS5  JST-Male-7  [JST-7]  (value not drawn)
XS6  JST-Male-7  [JST-7]  (value not drawn)
XS7  JST-Male-2  [JST-2]  (value not drawn)
XS8  JST-Male-2  [JST-2]  (value not drawn)

### Nets
+3.3: XS1.1 XS3.1 XS7.1
+5: DD4.CN11_6(E5V) XS5.1 XS6.1
AGND: DD4.CN12_32(AGND_CN12)
DGND: C54.1 C55.1 C56.1 DD4.CN11_8(GND_CN11) DD4.CN11_19(GND_CN11) DD4.CN11_20(GND_CN11) DD4.CN11_22(GND_CN11) DD4.CN11_49(GND_CN11) DD4.CN11_60(GND_CN11) DD4.CN11_71(GND_CN11) DD4.CN11_72(GND_CN11) DD4.CN12_9(GND_CN12) DD4.CN12_20(GND_CN12) DD4.CN12_39(GND_CN12) DD4.CN12_54(GND_CN12) DD4.CN12_63(GND_CN12) DD4.CN12_71(GND_CN12) DD4.CN12_72(GND_CN12) XS2.2 XS3.3 XS4.2 XS5.2 XS5.7 XS6.2 XS8.2
AH_MCU: DD4.CN12_52(PE9)
AL_MCU: DD4.CN12_40(PE8)
BEMF_U: DD4.CN12_13(PA6)
BEMF_V: DD4.CN12_24(PB1)
BEMF_W: DD4.CN12_58(PF3)
BH_MCU: DD4.CN12_56(PE11)
BL_MCU: DD4.CN12_47(PE10)
CAN_RX: DD4.CN11_57(PD0)
CAN_TX: DD4.CN11_55(PD1)
CH_MCU: DD4.CN12_55(PE13)
CL_MCU: DD4.CN12_49(PE12)
Current_U: R113.1
Current_V: R107.1
Current_W: R116.1
DC_Current_SM: DD4.CN11_35(PC2)
ENC_A: DD4.CN11_17(PA15)
ENC_B: DD4.CN12_31(PB3)
ENC_Z: DD4.CN12_25(PB10)
HALL_A: DD4.CN12_43(PD12)
HALL_B: DD4.CN12_41(PD13)
HALL_C: DD4.CN12_46(PD14)
PWM_SD: R119.1
RS485_RX: DD4.CN11_43(PD6)
RS485_TX: DD4.CN11_41(PD5)
SPI3_CS: DD4.CN11_45(PD7) R103.2
SPI3_MISO: DD4.CN11_2(PC11) R102.2
SPI3_MOSI: DD4.CN11_3(PC12) R101.2
SPI3_SCK: DD4.CN11_1(PC10) R100.2
Temp_SM: DD4.CN12_36(PF5)
TFT_CS: DD4.CN12_17(PB6) R132.2
TFT_D_C: DD4.CN12_27(PB4) R133.2
TFT_MOSI: DD4.CN12_29(PB5) R126.2
TFT_RES: DD4.CN12_3(PB8) R129.2
TFT_SCK: DD4.CN12_11(PA5) R125.2
USR_BTN1: C54.2 R63.1
USR_BTN2: C56.2 R66.1
USR_LED1: R62.1
USR_LED2: R65.1
USR_LED3: R67.1
USR_POT: C55.2 DD4.CN12_38(PF4) R64.1
V_DC_SM: DD4.CN11_11(PF7)
NetDD4_CN11_9: DD4.CN11_9(PF6) R116.2
NetDD4_CN11_28: DD4.CN11_28(PA0) R113.2
NetDD4_CN12_37: DD4.CN12_37(PA3) R107.2
NetDD4_CN12_53: DD4.CN12_53(PE15) R119.2
NetR62_2: R62.2 XS2.1
NetR63_2: R63.2 XS1.2
NetR64_2: R64.2 XS3.2
NetR65_2: R65.2 XS4.1
NetR66_2: R66.2 XS7.2
NetR67_2: R67.2 XS8.1
NetR100_1: R100.1 XS5.3
NetR101_1: R101.1 XS5.4
NetR102_1: R102.1 XS5.5
NetR103_1: R103.1 XS5.6
NetR125_1: R125.1 XS6.3
NetR126_1: R126.1 XS6.4
NetR129_1: R129.1 XS6.5
NetR132_1: R132.1 XS6.6
NetR133_1: R133.1 XS6.7

Not connected (* = marked no-connect by the designer): DD4 CN11_4(PD2) CN11_5(VDD) CN11_7(BOOT0) CN11_12(IOREF) CN11_13(PA13) CN11_14(RESET) CN11_15(PA14) CN11_16(+3V3) CN11_18(+5V) CN11_21(PB7) CN11_23(PC13) CN11_24(VIN) CN11_25(PC14) CN11_27(PC15) CN11_29(PH0) CN11_30(PA1) CN11_31(PH1) CN11_32(PA4) CN11_33(VBAT) CN11_34(PB0) CN11_36(PC1) CN11_37(PC3) CN11_38(PC0) CN11_39(PD4) CN11_40(PD3) CN11_42(PG2) CN11_44(PG3) CN11_46(PE2) CN11_47(PE3) CN11_48(PE4) CN11_50(PE5) CN11_51(PF1) CN11_52(PF2) CN11_53(PF0) CN11_54(PF8) CN11_56(PF9) CN11_58(PG1) CN11_59(PG0) CN11_61(PE1) CN11_62(PE6) CN11_63(PG9) CN11_64(PG15) CN11_65(PG12) CN11_66(PG10) CN11_68(PG13) CN11_69(PD9) CN11_70(PG11) CN12_1(PC9) CN12_2(PC8) CN12_4(PC6) CN12_5(PB9) CN12_6(PC5) CN12_7(AVDD_CN12) CN12_8(U5V) CN12_10(PD8) CN12_12(PA12) CN12_14(PA11) CN12_15(PA7) CN12_16(PB12) CN12_18(PB11) CN12_19(PC7) CN12_21(PA9) CN12_22(PB2) CN12_23(PA8) CN12_26(PB15) CN12_28(PB14) CN12_30(PB13) CN12_33(PA10) CN12_34(PC4) CN12_35(PA2) CN12_42(PF10) CN12_44(PE7) CN12_45(PD11) CN12_48(PD15) CN12_50(PF14) CN12_51(PE14) CN12_57(PF13) CN12_59(PF12) CN12_60(PF15) CN12_61(PG14) CN12_62(PF11) CN12_64(PE0) CN12_65(PD10) CN12_66(PG8) CN12_67(PG7) CN12_68(PG5) CN12_69(PG4) CN12_70(PG6)

### Notes on the sheet
- Подп. и дата
- Инв. № дубл.
- Взам. инв. №
- Инв. № подл.
- Изм.
- Лист
- № докум.
- Подп.
- Дата
- Форма 2а ГОСТ 2.104-2006
- Копировал
- Формат А3
- (in symbol NUCLEO-F767ZI, part A) CN11
- (in symbol NUCLEO-F767ZI, part B) CN12

### Library data of the parts
C54-C56 = Capacitor: Voltage: 50 В; ComponentLink1Description: Product link; ComponentLink1URL: *; Name: CC0603; GOST_Name_1: =Name; GOST_Name_2: 50 В; GOST_Name_0: -
  C54 C56: GOST_Name_3: 0.1 мкФ
  C55: GOST_Name_3: 10 нФ
DD4 = NUCLEO-F767ZI: STM32 Nucleo-144 development board with STM32F767ZI MCU, supports Arduino, ST Zio and morpho connectivity; MP: NUCLEO-F429ZI; MF: STMicroelectronics; Name: NUCLEO-F429ZI, ф. STMicroelectronics; Package: None; Price: None; Value: *; Availability: Unavailable; GOST_Name_1: NUCLEO-F429ZI, ф. STMicroelectronics
R62 R65 R67 = Resistor: Power: 250 мВт; ComponentLink1Description: Product link; ComponentLink1URL: *; Name: RC1206; GOST_Name_1: =Name; GOST_Name_2: 250 мВт; GOST_Name_3: 330 Ом; GOST_Name_0: -
R63 R64 R66 R100-R103 R107 R113 R116 R119 R125 R126 R129 R132 R133 = Resistor: Power: 100 мВт; ComponentLink1Description: Product link; ComponentLink1URL: *; Name: RC0603; GOST_Name_1: =Name; GOST_Name_2: 100 мВт; GOST_Name_0: -
  R63 R64 R66 R107 R113 R116: GOST_Name_3: 1 кОм
  R100-R103 R119 R125 R126 R129 R132 R133: GOST_Name_3: 100 Ом
XS1 XS2 XS4 XS7 XS8 = JST-Male-2: Name: JST-2.54 x2; GOST_Name_1: JST-2.54 x2
XS3 = JST-Male-3: Name: JST-2.54 x3
XS5 XS6 = JST-Male-7: Name: JST-2.54 x7; GOST_Name_1: JST-2.54 x7

## Sheet position_sensors.SchDoc
size 420 x 297 mm; SheetNumber: 2
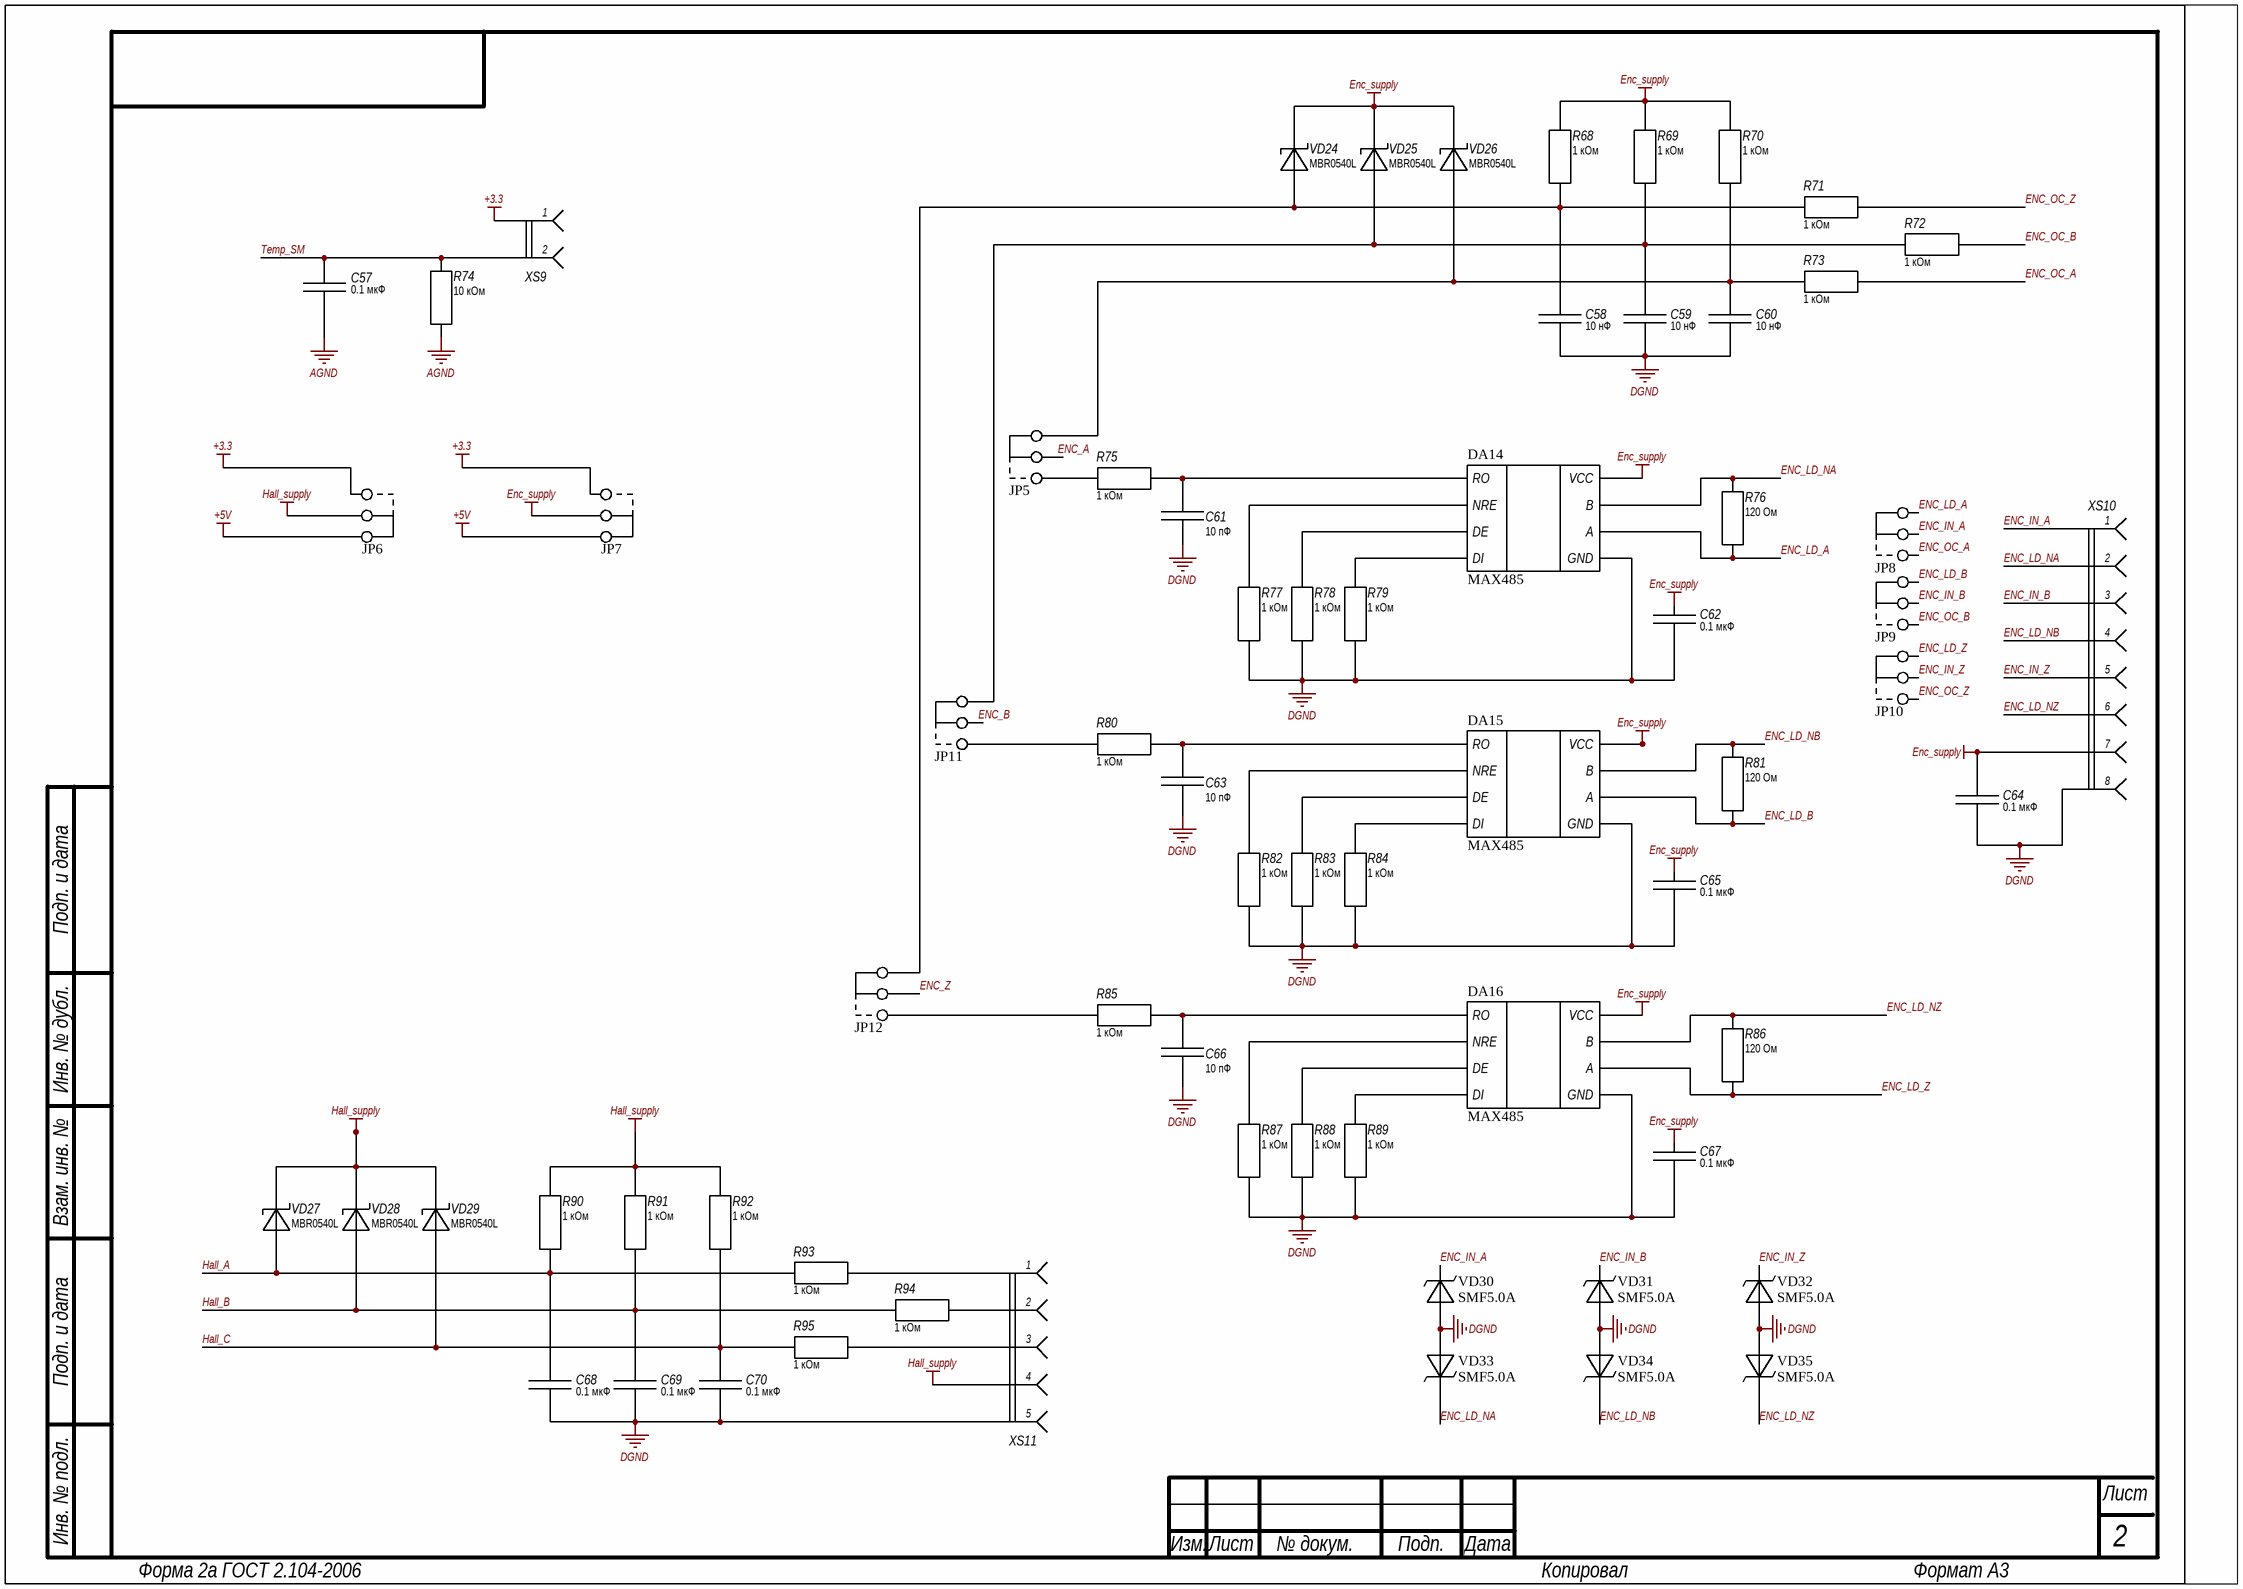
[diagram p3: position_sensors.SchDoc]

### Parts
C57  value 0.1 мкФ  [CC0805]  (hidden comment: Capacitor)
C58  value 10 нФ  [CC0805]  (hidden comment: Capacitor)
C59  value 10 нФ  [CC0805]  (hidden comment: Capacitor)
C60  value 10 нФ  [CC0603]  (hidden comment: Capacitor)
C61  value 10 пФ  [CC0603]  (hidden comment: Capacitor)
C62  value 0.1 мкФ  [CC0603]  (hidden comment: Capacitor)
C63  value 10 пФ  [CC0603]  (hidden comment: Capacitor)
C64  value 0.1 мкФ  [CC0603]  (hidden comment: Capacitor)
C65  value 0.1 мкФ  [CC0603]  (hidden comment: Capacitor)
C66  value 10 пФ  [CC0603]  (hidden comment: Capacitor)
C67  value 0.1 мкФ  [CC0603]  (hidden comment: Capacitor)
C68  value 0.1 мкФ  [CC0805]  (hidden comment: Capacitor)
C69  value 0.1 мкФ  [CC0805]  (hidden comment: Capacitor)
C70  value 0.1 мкФ  [CC0805]  (hidden comment: Capacitor)
DA14  MAX485  [SO8]
DA15  MAX485  [SO8]
DA16  MAX485  [SO8]
JP5  Jumper  [PLS3]  (value not drawn)
JP6  Jumper  [PLS3]  (value not drawn)
JP7  Jumper  [PLS3]  (value not drawn)
JP8  Jumper  [PLS3]  (value not drawn)
JP9  Jumper  [PLS3]  (value not drawn)
JP10  Jumper  [PLS3]  (value not drawn)
JP11  Jumper  [PLS3]  (value not drawn)
JP12  Jumper  [PLS3]  (value not drawn)
R68  value 1 кОм  [RC1206]  (hidden comment: Resistor)
R69  value 1 кОм  [RC1206]  (hidden comment: Resistor)
R70  value 1 кОм  [RC1206]  (hidden comment: Resistor)
R71  value 1 кОм  [RC1206]  (hidden comment: Resistor)
R72  value 1 кОм  [RC1206]  (hidden comment: Resistor)
R73  value 1 кОм  [RC1206]  (hidden comment: Resistor)
R74  value 10 кОм  [RC0805]  (hidden comment: Resistor)
R75  value 1 кОм  [RC0603]  (hidden comment: Resistor)
R76  value 120 Ом  [RC1206]  (hidden comment: Resistor)
R77  value 1 кОм  [RC0603]  (hidden comment: Resistor)
R78  value 1 кОм  [RC0603]  (hidden comment: Resistor)
R79  value 1 кОм  [RC0603]  (hidden comment: Resistor)
R80  value 1 кОм  [RC0603]  (hidden comment: Resistor)
R81  value 120 Ом  [RC1206]  (hidden comment: Resistor)
R82  value 1 кОм  [RC0603]  (hidden comment: Resistor)
R83  value 1 кОм  [RC0603]  (hidden comment: Resistor)
R84  value 1 кОм  [RC0603]  (hidden comment: Resistor)
R85  value 1 кОм  [RC0603]  (hidden comment: Resistor)
R86  value 120 Ом  [RC1206]  (hidden comment: Resistor)
R87  value 1 кОм  [RC0603]  (hidden comment: Resistor)
R88  value 1 кОм  [RC0603]  (hidden comment: Resistor)
R89  value 1 кОм  [RC0603]  (hidden comment: Resistor)
R90  value 1 кОм  [RC1206]  (hidden comment: Resistor)
R91  value 1 кОм  [RC1206]  (hidden comment: Resistor)
R92  value 1 кОм  [RC1206]  (hidden comment: Resistor)
R93  value 1 кОм  [RC1206]  (hidden comment: Resistor)
R94  value 1 кОм  [RC1206]  (hidden comment: Resistor)
R95  value 1 кОм  [RC1206]  (hidden comment: Resistor)
VD24  MBR0540L  [SOD123]
VD25  MBR0540L  [SOD123]
VD26  MBR0540L  [SOD123]
VD27  MBR0540L  [SOD123]
VD28  MBR0540L  [SOD123]
VD29  MBR0540L  [SOD123]
VD30  SMF5.0A  [D0-124AC]
VD31  SMF5.0A  [D0-124AC]
VD32  SMF5.0A  [D0-124AC]
VD33  SMF5.0A  [D0-124AC]
VD34  SMF5.0A  [D0-124AC]
VD35  SMF5.0A  [D0-124AC]
XS9  JST-Male-2  [JST-2]  (value not drawn)
XS10  DG141V-2.54-05P-14-00AH  [DG141V-2.54-08P]  (value not drawn)
XS11  DG141V-2.54-05P-14-00AH  [DG141V-2.54-05P]  (value not drawn)

### Nets
+3.3: JP6.1 JP7.1 XS9.1
+5V: JP6.3 JP7.3
AGND: C57.1 R74.2
DGND: C58.1 C59.1 C60.1 C61.2 C62.1 C63.2 C64.1 C65.1 C66.2 C67.1 C68.1 C69.1 C70.1 DA14.8(GND) DA15.8(GND) DA16.8(GND) R77.2 R78.2 R79.2 R82.2 R83.2 R84.2 R87.2 R88.2 R89.2 VD30.A VD31.A VD32.A VD33.A VD34.A VD35.A XS10.8 XS11.5
Enc_supply: C62.2 C64.2 C65.2 C67.2 DA14.5(VCC) DA15.5(VCC) DA16.5(VCC) JP7.2 R68.2 R69.2 R70.2 VD24.C VD25.C VD26.C XS10.7
Hall_supply: JP6.2 R90.2 R91.2 R92.2 VD27.C VD28.C VD29.C XS11.4
ENC_A: JP5.2
ENC_B: JP11.2
ENC_IN_A: JP8.2 VD30.C XS10.1
ENC_IN_B: JP9.2 VD31.C XS10.3
ENC_IN_Z: JP10.2 VD32.C XS10.5
ENC_LD_A: DA14.7(A) JP8.3 R76.1
ENC_LD_B: DA15.7(A) JP9.3 R81.1
ENC_LD_NA: DA14.6(B) R76.2 VD33.C XS10.2
ENC_LD_NB: DA15.6(B) R81.2 VD34.C XS10.4
ENC_LD_NZ: DA16.6(B) R86.2 VD35.C XS10.6
ENC_LD_Z: DA16.7(A) JP10.3 R86.1
ENC_OC_A: JP8.1 R73.2
ENC_OC_B: JP9.1 R72.2
ENC_OC_Z: JP10.1 R71.2
ENC_Z: JP12.2
HALL_A: C68.2 R90.1 R93.1 VD27.A
HALL_B: C69.2 R91.1 R94.1 VD28.A
HALL_C: C70.2 R92.1 R95.1 VD29.A
Temp_SM: C57.2 R74.1 XS9.2
NetC58_2: C58.2 JP12.3 R68.1 R71.1 VD24.A
NetC59_2: C59.2 JP11.3 R69.1 R72.1 VD25.A
NetC60_2: C60.2 JP5.3 R70.1 R73.1 VD26.A
NetC61_1: C61.1 DA14.1(RO) R75.1
NetC63_1: C63.1 DA15.1(RO) R80.1
NetC66_1: C66.1 DA16.1(RO) R85.1
NetDA14_2: DA14.2(NRE) R77.1
NetDA14_3: DA14.3(DE) R78.1
NetDA14_4: DA14.4(DI) R79.1
NetDA15_2: DA15.2(NRE) R82.1
NetDA15_3: DA15.3(DE) R83.1
NetDA15_4: DA15.4(DI) R84.1
NetDA16_2: DA16.2(NRE) R87.1
NetDA16_3: DA16.3(DE) R88.1
NetDA16_4: DA16.4(DI) R89.1
NetJP5_1: JP5.1 R75.2
NetJP11_1: JP11.1 R80.2
NetJP12_1: JP12.1 R85.2
NetR93_2: R93.2 XS11.1
NetR94_2: R94.2 XS11.2
NetR95_2: R95.2 XS11.3

### Notes on the sheet
- Подп. и дата
- Инв. № дубл.
- Взам. инв. №
- Инв. № подл.
- Изм.
- Лист
- № докум.
- Подп.
- Дата
- Форма 2а ГОСТ 2.104-2006
- Копировал
- Формат А3

### Library data of the parts
C57 = Capacitor: Voltage: 50 В; ComponentLink1Description: Product link; ComponentLink1URL: *; Name: CC0805; GOST_Name_1: =Name; GOST_Name_2: 50 В; GOST_Name_3: 0.1 мкФ; GOST_Name_0: -
C58 C59 C62 C64 C65 C67 = Capacitor: Voltage: 16В; ComponentLink1Description: Product link; ComponentLink1URL: *; GOST_Name_1: =Name; GOST_Name_2: 16В; GOST_Name_0: -
  C58 C59: Name: CC0805; GOST_Name_3: 10 нФ
  C62 C64 C65 C67: Name: CC0603; GOST_Name_3: 0.1 мкФ
C60 C61 C63 C66 C68-C70 = Capacitor: Voltage: 50В; ComponentLink1Description: Product link; ComponentLink1URL: *; GOST_Name_1: =Name; GOST_Name_2: 50В; GOST_Name_0: -
  C60: Name: CC0603; GOST_Name_3: 10 нФ
  C61 C63 C66: Name: CC0603; GOST_Name_3: 10 пФ
  C68-C70: Name: CC0805; GOST_Name_3: 0.1 мкФ
DA14-DA16 = MAX485ESA: GOST_Name_1: MAX485ESA+ ф. Maxim Integrated; ComponentLink1Description: Product link; ComponentLink1URL: https://www.platan.ru/cgi-bin/qwery.pl/id=355590810; Datasheet: https://doc.platan.ru/pdf/datasheets/maxim/MAX1487E-MAX491E-101921.pdf
R68-R73 R76 R81 R86 R90-R95 = Resistor: Power: 250 мВт; ComponentLink1Description: Product link; ComponentLink1URL: *; Name: RC1206; GOST_Name_1: =Name; GOST_Name_2: 250 мВт; GOST_Name_0: -
  R68-R73 R90-R95: GOST_Name_3: 1 кОм
  R76 R81 R86: GOST_Name_3: 120 Ом
R74 = Resistor: Power: 125 мВт; ComponentLink1Description: Product link; ComponentLink1URL: *; Name: RC0805; GOST_Name_1: =Name; GOST_Name_2: 125 мВт; GOST_Name_3: 10 кОм; GOST_Name_0: -
R75 R80 R85 = Resistor: Power: 100мВт; ComponentLink1Description: Product link; ComponentLink1URL: *; Name: RC0603; GOST_Name_1: =Name; GOST_Name_2: 100мВт; GOST_Name_3: 1 кОм; GOST_Name_0: -
R77-R79 R82-R84 R87-R89 = Resistor: Power: 100 мВт; ComponentLink1Description: Product link; ComponentLink1URL: *; Name: RC0603; GOST_Name_1: =Name; GOST_Name_2: 100 мВт; GOST_Name_3: 1 кОм; GOST_Name_0: -
VD24-VD29 = Shotki: Name: MBR0540L, 40В, 0.5А, ф. Hottech; ComponentLink1Description: Product link; GOST_Name_1: MBR0540L, 40В, 0.5А, ф. Hottech
VD30-VD35 = TVS Diode: GOST_Name_1: SMF5.0A, Диод защитный 5В 200Вт; ComponentLink1Description: Product link
  VD30: ComponentLink1URL: https://www.chipdip.ru/product/smf5.0a-umw
XS9 = JST-Male-2: Name: JST-2.54 x2; GOST_Name_1: JST-2.54 x2
XS10 = DG141V-2.54-08P-14-00A(H): Name: DG141V-2.54-08P-14-00A(H), ф. Degson Electronics Co; ComponentLink1Description: Product link; ComponentLink1URL: https://www.promelec.ru/product/102606/; GOST_Name_1: DG141V-2.54-08P-14-00A(H), ф. Degson Electronics Co
XS11 = DG141V-2.54-05P-14-00AH: Name: DG141V-2.54-05P-14-00AH, ф. Degson Electronics Co; ComponentLink1Description: Product link; ComponentLink1URL: https://www.promelec.ru/product/403282/; GOST_Name_1: DG141V-2.54-05P-14-00AH, ф. Degson Electronics Co
JP5-JP12 = Jumper: ComponentLink1Description: Product link; ComponentLink1URL: https://www.chipdip.ru/product/stps2h100a-2

## Sheet Communication_interfaces.SchDoc
size 420 x 297 mm; SheetNumber: 4
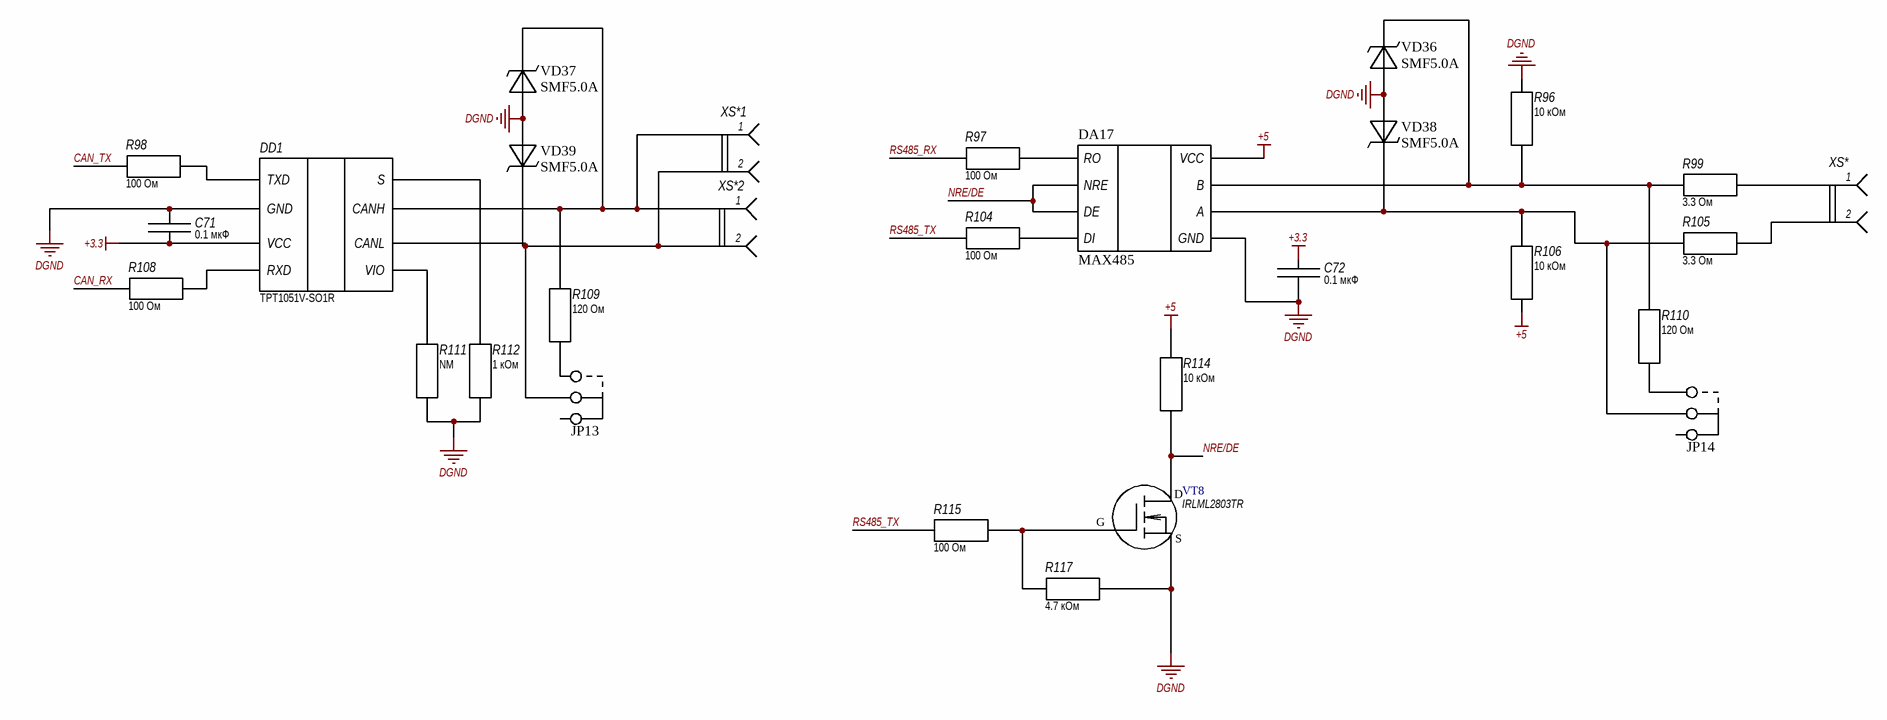
[diagram p4: Communication_interfaces.SchDoc]

### Parts
C71  value 0.1 мкФ  [CC0603]  (hidden comment: Capacitor)
C72  value 0.1 мкФ  [CC0603]  (hidden comment: Capacitor)
DA17  MAX485  [SO8]
DD1  TPT1051V-SO1R  [SO8]
JP13  Jumper  [PLS3]  (value not drawn)
JP14  Jumper  [PLS3]  (value not drawn)
R96  value 10 кОм  [RC0805]  (hidden comment: Resistor)
R97  value 100 Ом  [RC0603]  (hidden comment: Resistor)
R98  value 100 Ом  [RC0603]  (hidden comment: Resistor)
R99  value 3.3 Ом  [RC1206]  (hidden comment: Resistor)
R104  value 100 Ом  [RC0603]  (hidden comment: Resistor)
R105  value 3.3 Ом  [RC1206]  (hidden comment: Resistor)
R106  value 10 кОм  [RC0805]  (hidden comment: Resistor)
R108  value 100 Ом  [RC0603]  (hidden comment: Resistor)
R109  value 120 Ом  [RC1206]  (hidden comment: Resistor)
R110  value 120 Ом  [RC1206]  (hidden comment: Resistor)
R111  value NM  [RC0603]  (hidden comment: Resistor)
R112  value 1 кОм  [RC0603]  (hidden comment: Resistor)
R114  value 10 кОм  [RC0805]  (hidden comment: Resistor)
R115  value 100 Ом  [RC0603]  (hidden comment: Resistor)
R117  value 4.7 кОм  [RC0603]  (hidden comment: Resistor)
VD36  SMF5.0A  [D0-124AC]
VD37  SMF5.0A  [D0-124AC]
VD38  SMF5.0A  [D0-124AC]
VD39  SMF5.0A  [D0-124AC]
VT8  IRLML2803TR  [SOT-23-3]
XS*  DG141V-2.54-02P-14-00AH  [DG141V-2.54-02P]  (value not drawn)
XS*1  DG141V-2.54-02P-14-00AH  [DG141V-2.54-02P]  (value not drawn)
XS*2  DG141V-2.54-02P-14-00AH  [DG141V-2.54-02P]  (value not drawn)

### Nets
+3.3: C71.1 C72.2 DD1.3(VCC)
+5: DA17.5(VCC) R106.2 R114.1
DGND: C71.2 C72.1 DA17.8(GND) DD1.2(GND) R96.1 R111.2 R112.2 R117.1 VD36.A VD37.A VD38.A VD39.A VT8.S
CAN_RX: R108.2
CAN_TX: R98.2
NRE/DE: DA17.2(NRE) DA17.3(DE) R114.2 VT8.D
RS485_RX: R97.2
RS485_TX: R104.2 R115.2
NetDA17_1: DA17.1(RO) R97.1
NetDA17_4: DA17.4(DI) R104.1
NetDA17_6: DA17.6(B) R96.2 R99.1 R110.1 VD36.C
NetDA17_7: DA17.7(A) JP14.2 R105.1 R106.1 VD38.C
NetDD1_1: DD1.1(TXD) R98.1
NetDD1_4: DD1.4(RXD) R108.1
NetDD1_5: DD1.5(VIO) R111.1
NetDD1_6: DD1.6(CANL) JP13.2 VD39.C XS*1.2 XS*2.2
NetDD1_7: DD1.7(CANH) R109.1 VD37.C XS*1.1 XS*2.1
NetDD1_8: DD1.8(S) R112.1
NetJP13_1: JP13.1 R109.2
NetJP14_1: JP14.1 R110.2
NetR99_2: R99.2 XS*.1
NetR105_2: R105.2 XS*.2
NetR115_1: R115.1 R117.2 VT8.G

Not connected (* = marked no-connect by the designer): JP13 3(6); JP14 3(6)

### Notes on the sheet
- Подп. и дата
- Инв. № дубл.
- Взам. инв. №
- Инв. № подл.
- Изм.
- Лист
- № докум.
- Подп.
- Дата
- Форма 2а ГОСТ 2.104-2006
- Копировал
- Формат А3

### Library data of the parts
C71 C72 = Capacitor: Voltage: 16В; ComponentLink1Description: Product link; ComponentLink1URL: *; Name: CC0603; GOST_Name_1: =Name; GOST_Name_2: 16В; GOST_Name_3: 0.1 мкФ; GOST_Name_0: -
DA17 = MAX485ESA: as DA14 on sheet position_sensors; ComponentLink1Description: Product link; ComponentLink1URL: https://www.platan.ru/cgi-bin/qwery.pl/id=355590810; Datasheet: https://doc.platan.ru/pdf/datasheets/maxim/MAX1487E-MAX491E-101921.pdf
DD1 = TPT1051V-SO1R: Физический уровень CAN; GOST_Name_1: TPT1051V-SO1R, ф. 3PEAK INCORPORATED; ComponentLink1Description: New link; ComponentLink1URL: https://www.chipdip.ru/product/max3051esa-maxim
R96 R106 R114 = Resistor: Power: 125 мВт; ComponentLink1Description: Product link; ComponentLink1URL: *; Name: RC0805; GOST_Name_1: =Name; GOST_Name_2: 125 мВт; GOST_Name_3: 10 кОм; GOST_Name_0: -
R97 R98 R104 R108 R111 R112 R115 R117 = Resistor: Power: 100 мВт; ComponentLink1Description: Product link; ComponentLink1URL: *; Name: RC0603; GOST_Name_1: =Name; GOST_Name_2: 100 мВт; GOST_Name_0: -
  R97 R98 R104 R108 R115: GOST_Name_3: 100 Ом
  R111: GOST_Name_3: NM
  R112: GOST_Name_3: 1 кОм
  R117: GOST_Name_3: 4.7 кОм
R99 R105 R109 R110 = Resistor: Power: 250 мВт; ComponentLink1Description: Product link; ComponentLink1URL: *; Name: RC1206; GOST_Name_1: =Name; GOST_Name_2: 250 мВт; GOST_Name_0: -
  R99 R105: GOST_Name_3: 3.3 Ом
  R109 R110: GOST_Name_3: 120 Ом
VD36-VD39 = TVS Diode: as VD30 on sheet position_sensors; ComponentLink1Description: Product link
VT8 = N-MOSFET: pin to pad: D>3 G>1 S>2; GOST_Name_1: IRLML2803TR; ComponentLink1Description: Product link; ComponentLink1URL: https://www.chipdip.ru/product/irlml2803tr-umw?utm_source=direct&utm_medium=cpc&position_type=premium|k50id|010000005534644_5534644|cid|108406362|gid|5417216457|aid|15932497800|src|search_none&utm_campaign=Y_dinamicheskaya&utm_content=text1_ya&utm_term=&yclid=717148778588012543
XS* XS*1 XS*2 = DG141V-2.54-02P-14-00AH: GOST_Name_1: DG141V-2.54-02P-14-00AH, ф. Degson Electronics Co; ComponentLink1Description: Product link; ComponentLink1URL: https://www.promelec.ru/product/403282/
JP13 JP14 = Jumper: ComponentLink1Description: Product link; ComponentLink1URL: https://www.chipdip.ru/product/stps2h100a-2